# EAGLE design 64Pin-2 (EAGLE 7.2.0)
64 Pin Board to mount PIC24FJ1024GB606E
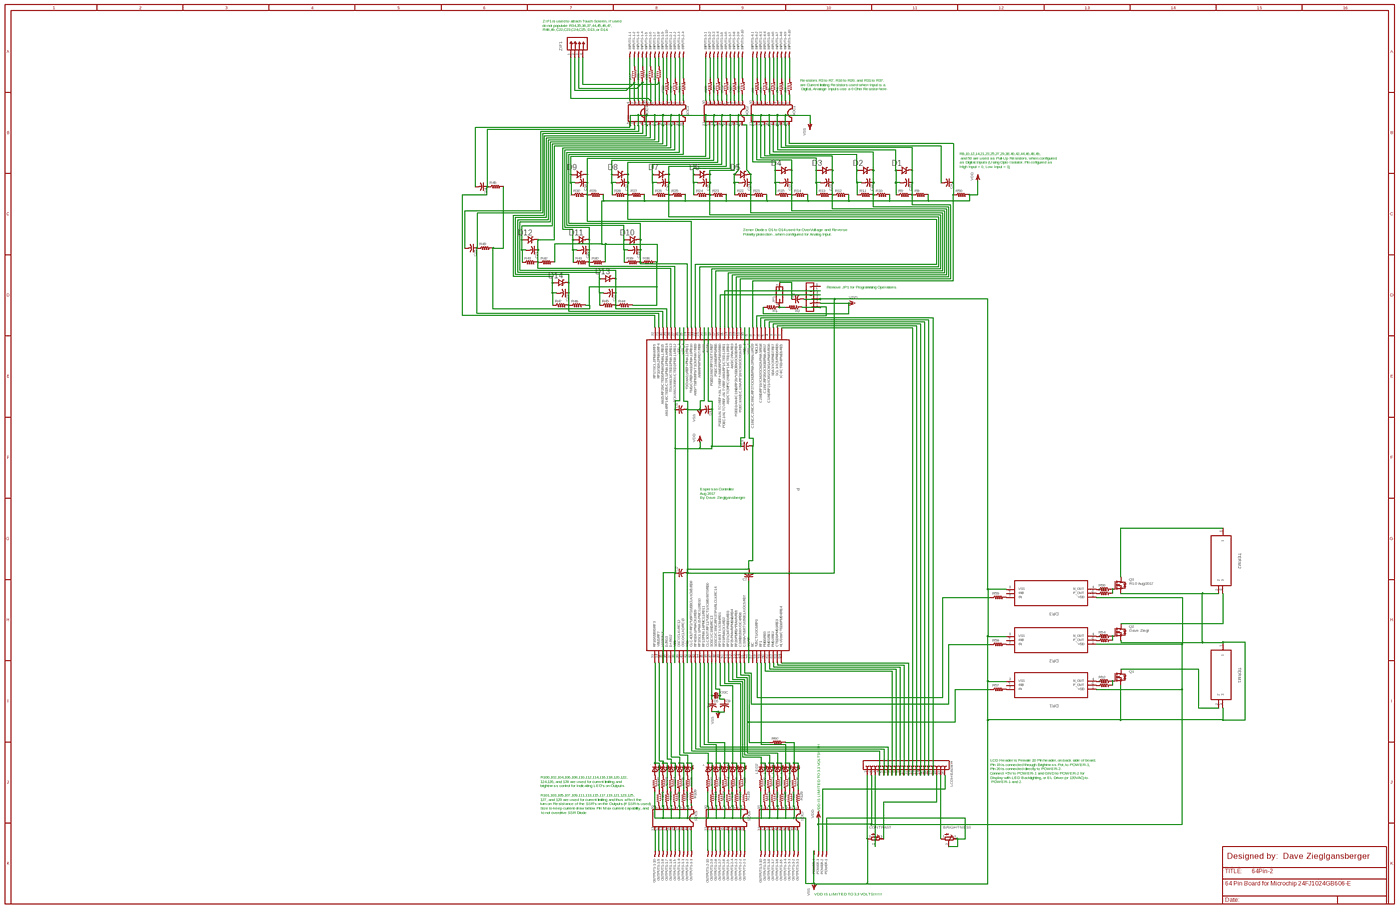
[diagram p0: schematic, sheet 1, overview]
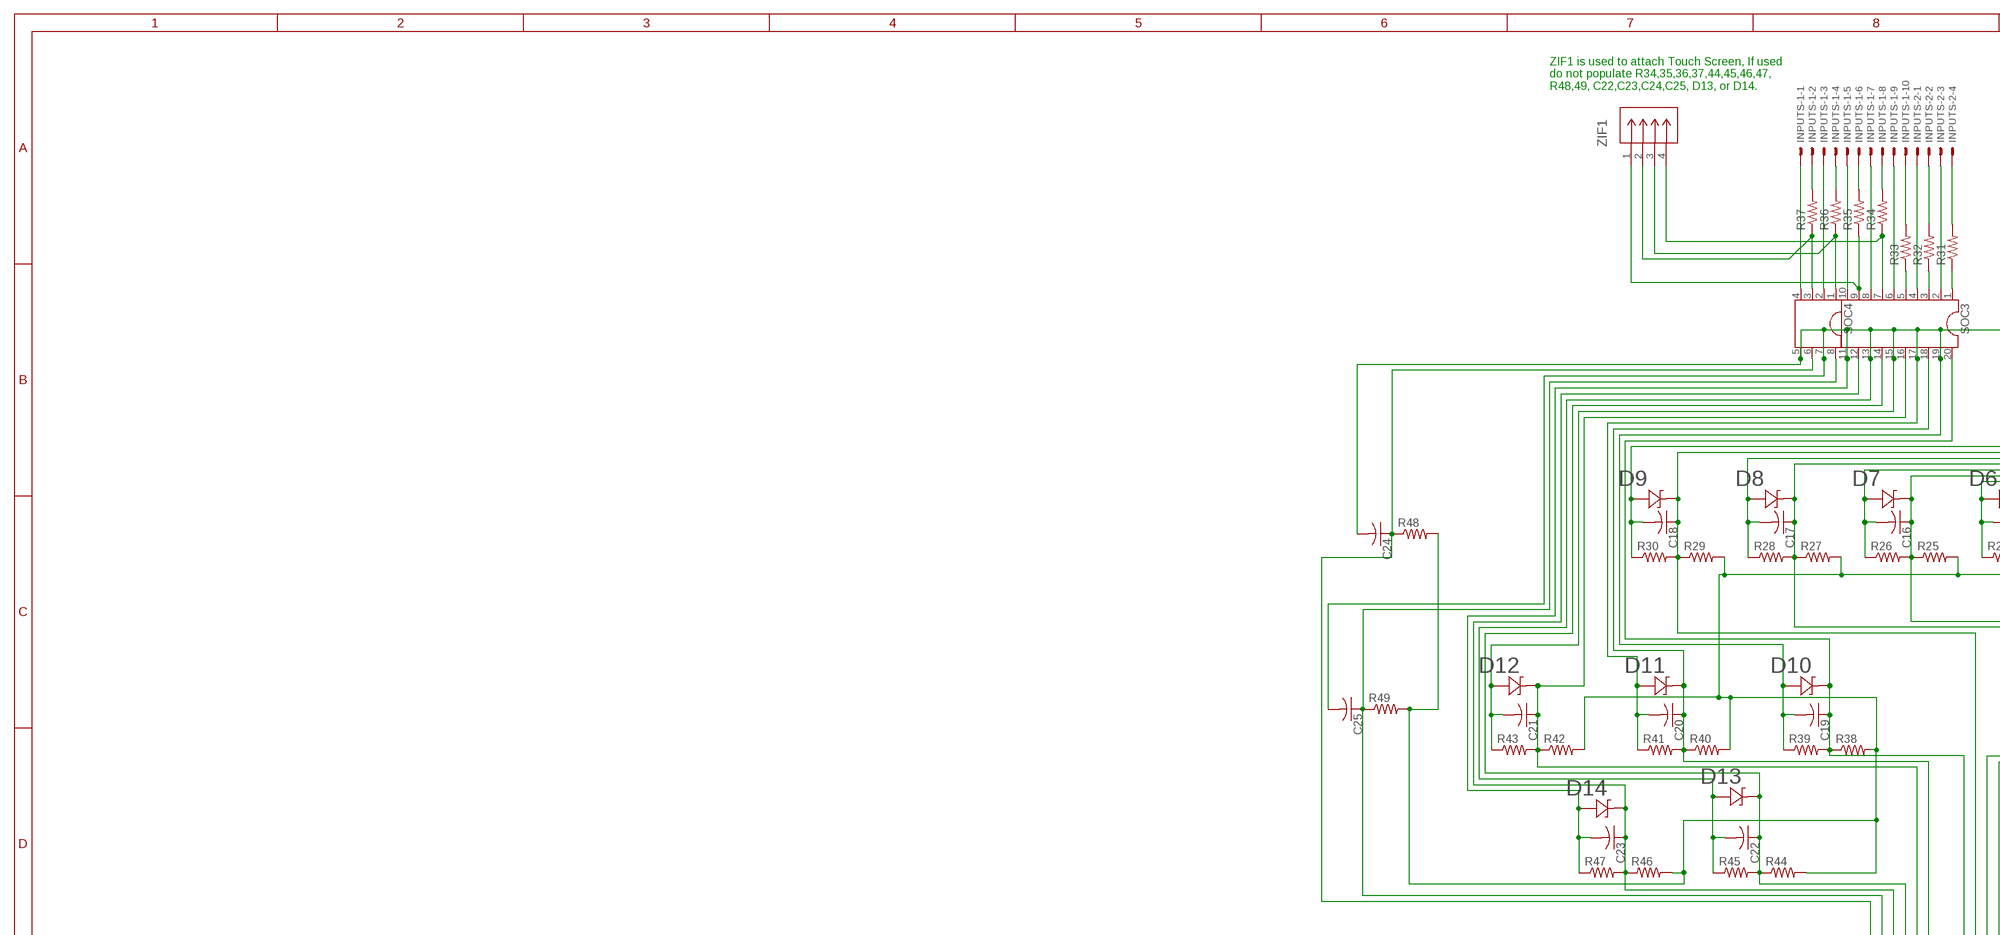
[diagram p1: schematic, sheet 1, part 1 of 4]
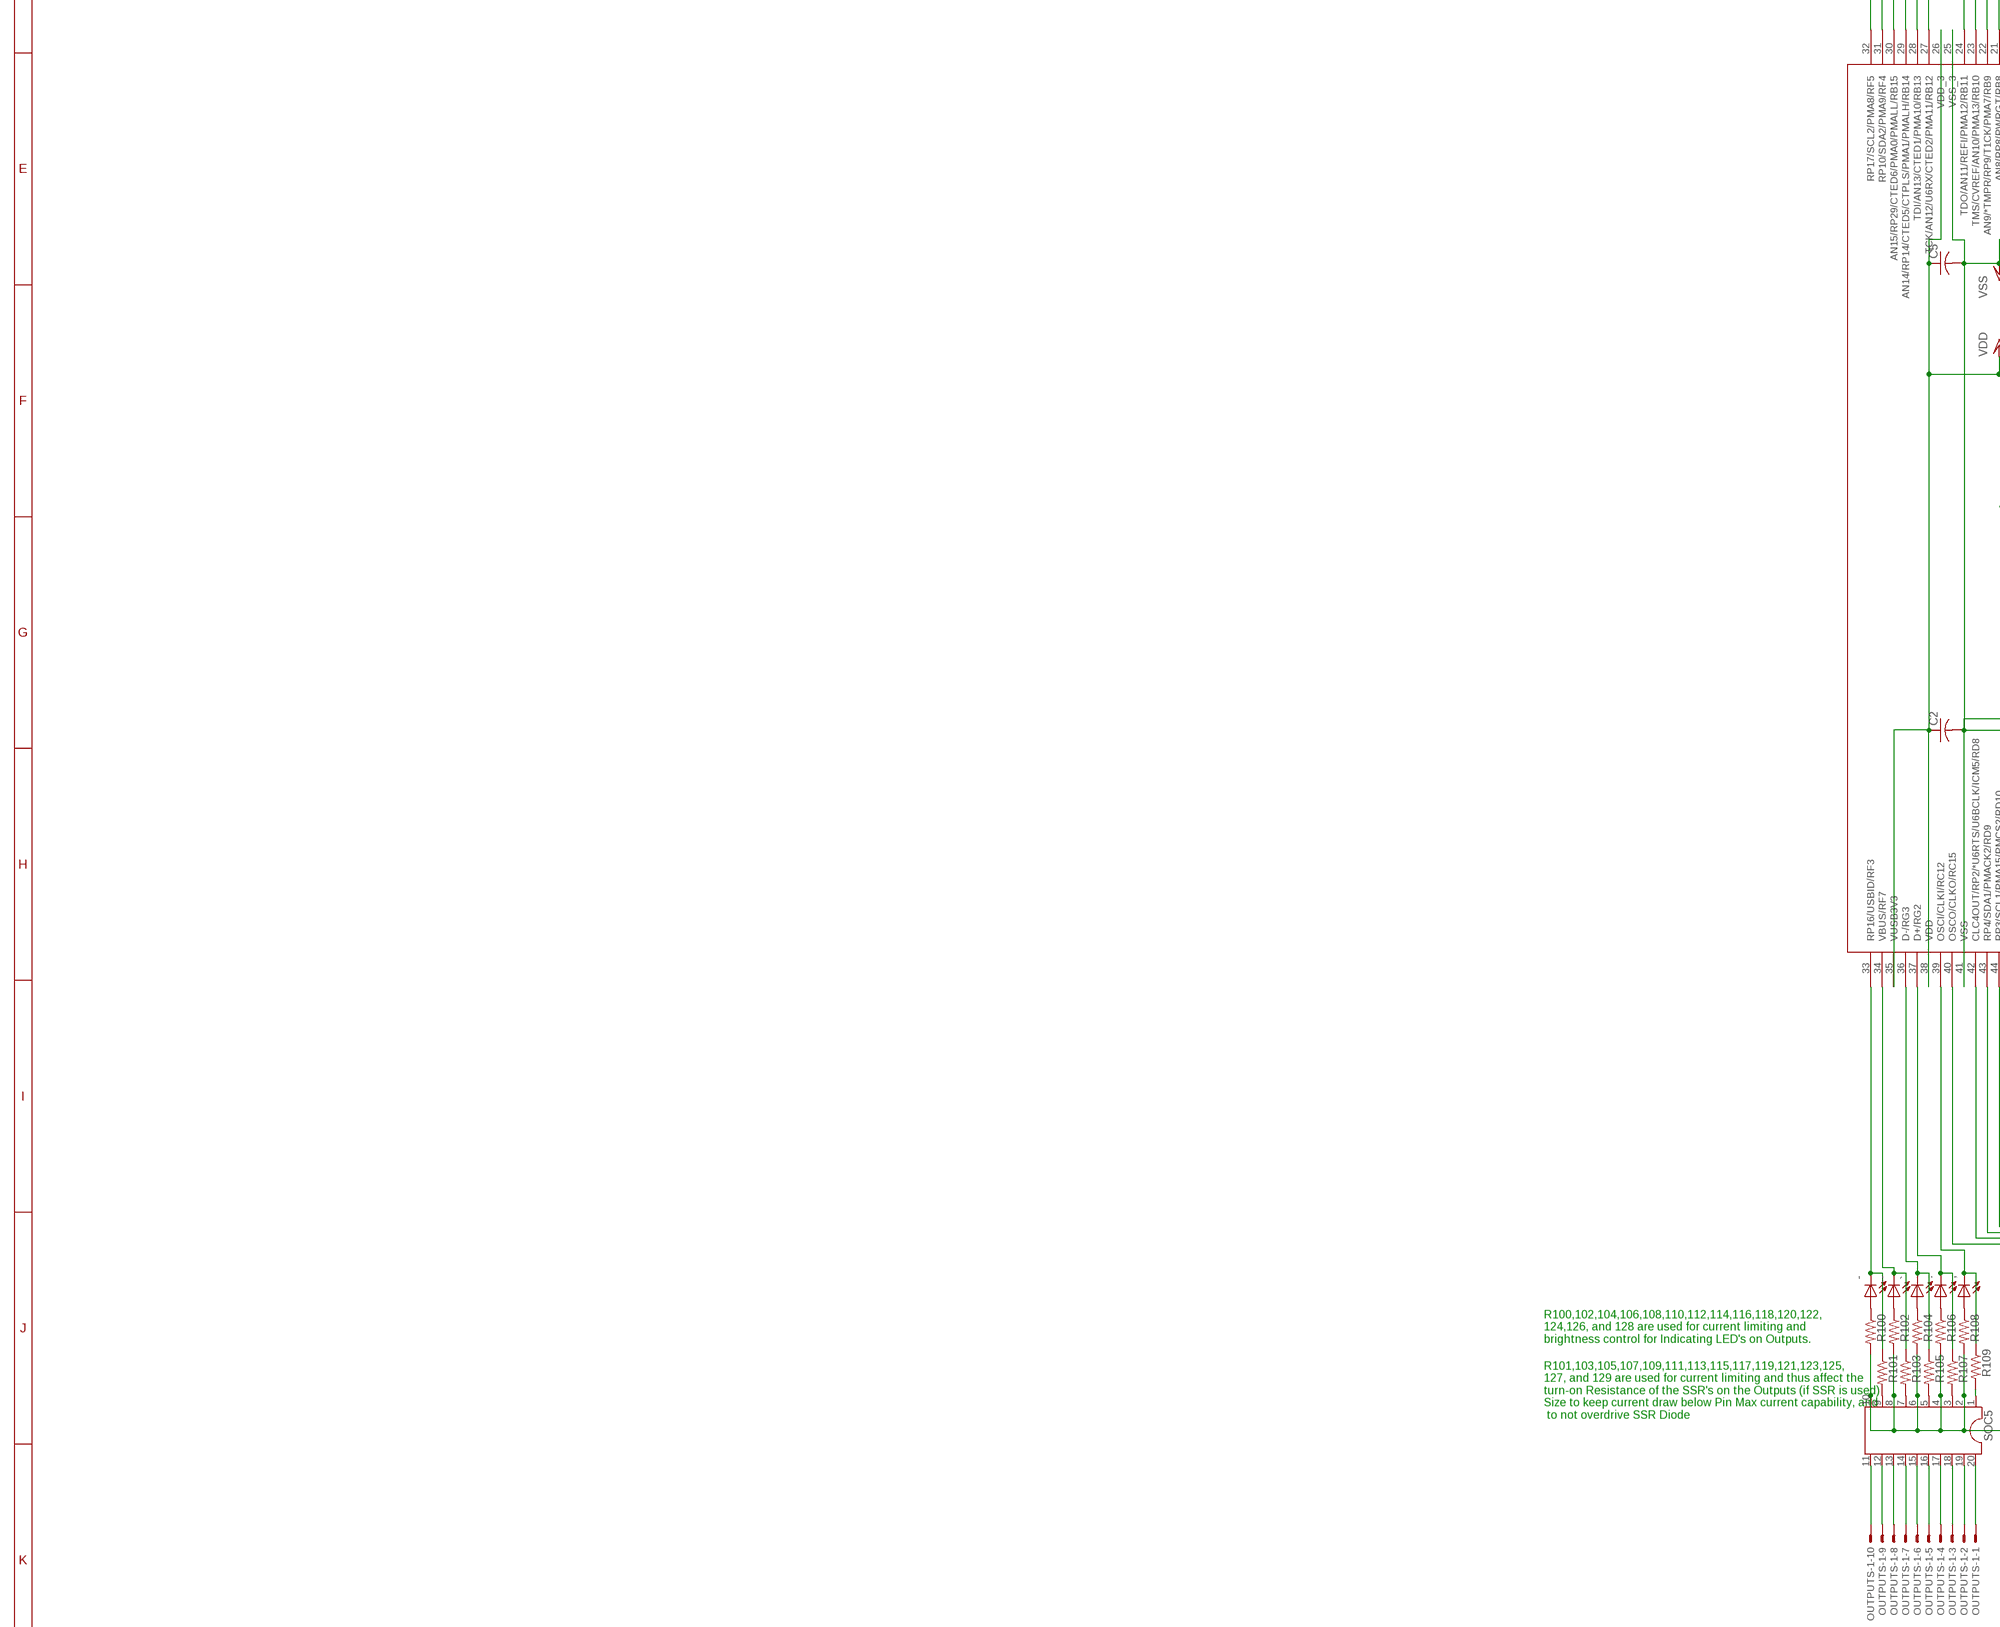
[diagram p2: schematic, sheet 1, part 2 of 4]
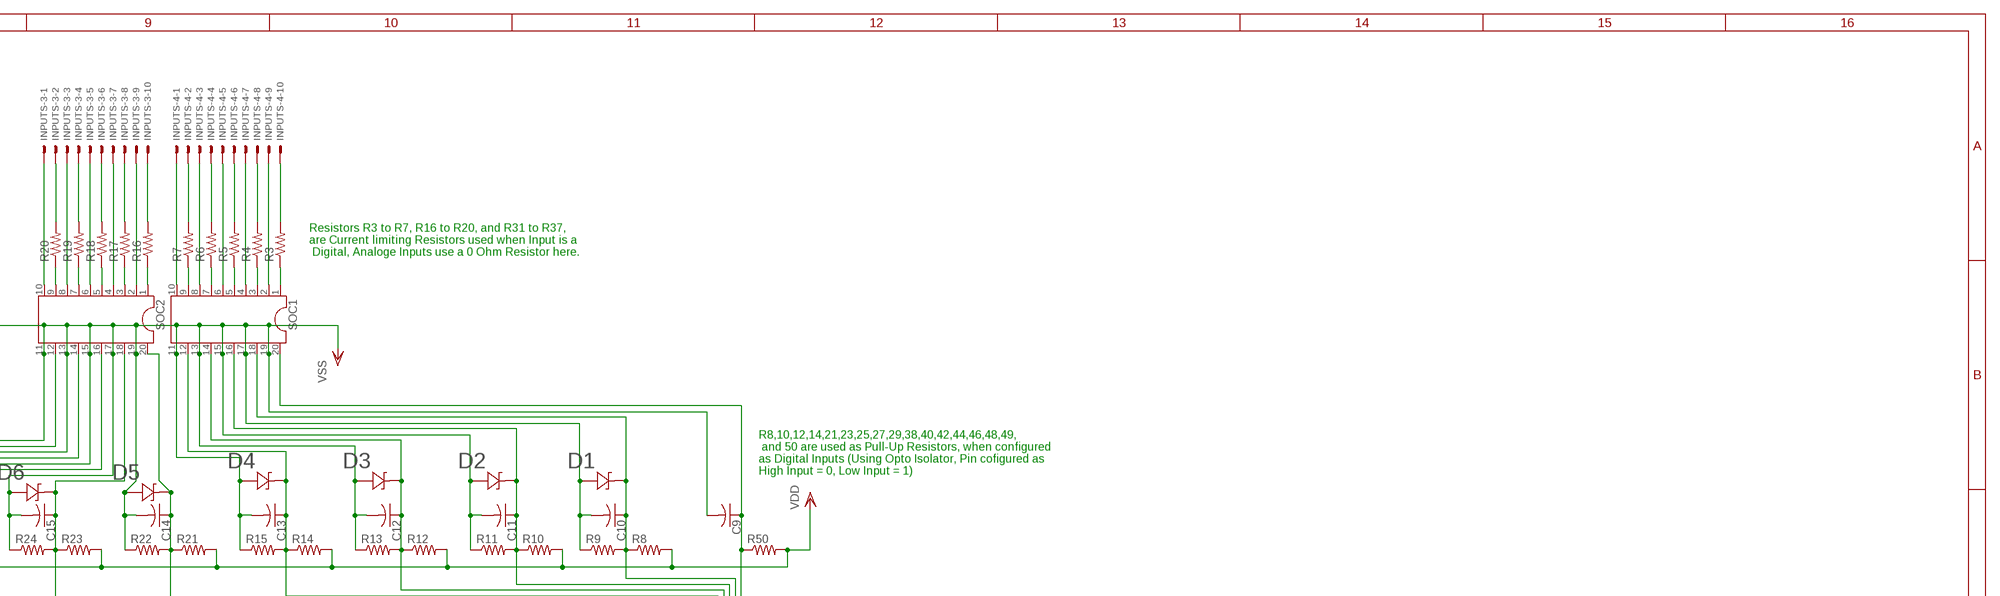
[diagram p3: schematic, sheet 1, part 3 of 4]
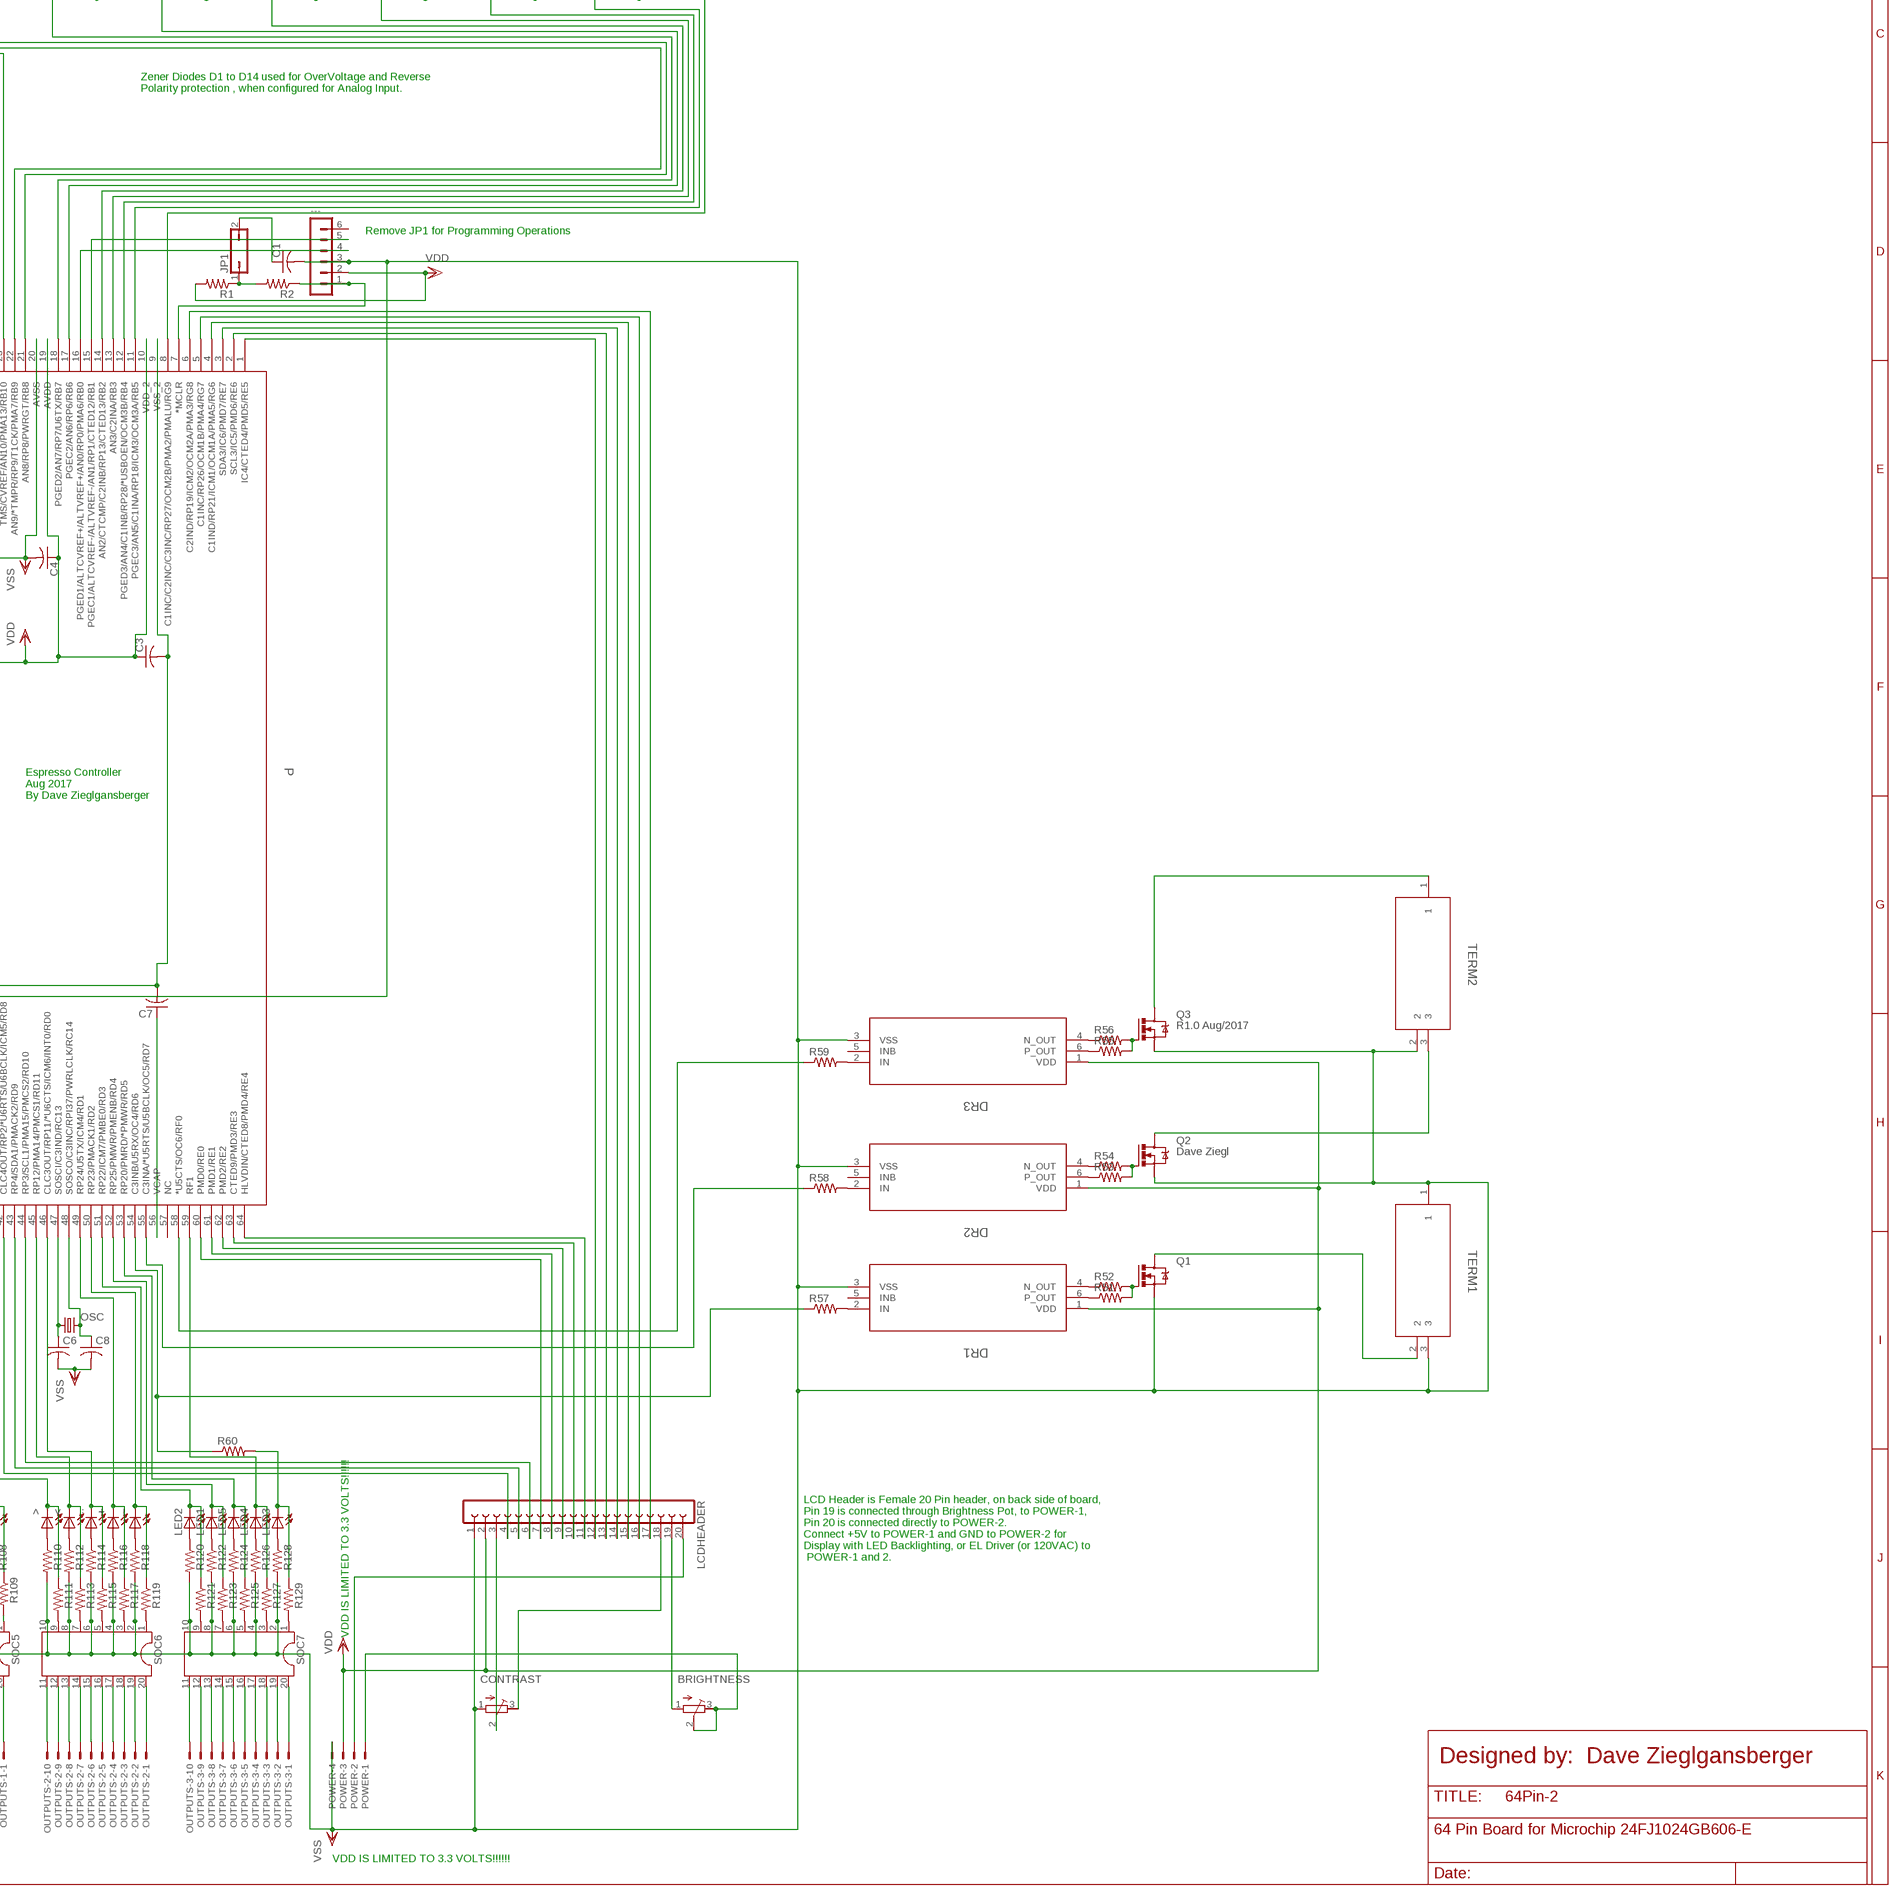
[diagram p4: schematic, sheet 1, part 4 of 4]

## Parts
+  LED_ESML0603  [LED_SML0603]
,  LED_ESML0603  [LED_SML0603]
-  LED_ESML0603  [LED_SML0603]
--  LED_ESML0603  [LED_SML0603]
---  MA06-1  [MA06-1]
.  LED_ESML0603  [LED_SML0603]
..  LED_ESML0603  [LED_SML0603]
<  LED_ESML0603  [LED_SML0603]
>  LED_ESML0603  [LED_SML0603]
`  LED_ESML0603  [LED_SML0603]
BRIGHTNESS  R-TRIMM3296W  [RTRIM3296W]
C1  C-USC0603  [C0603]
C2  C-USC0603  [C0603]
C3  C-USC0603  [C0603]
C4  C-USC0603  [C0603]
C5  C-USC0603  [C0603]
C6  C-USC0603  [C0603]
C7  C-USC0603  [C0603]
C8  C-USC0603  [C0603]
C9  C-USC0603  [C0603]
C10  C-USC0603  [C0603]
C11  C-USC0603  [C0603]
C12  C-USC0603  [C0603]
C13  C-USC0603  [C0603]
C14  C-USC0603  [C0603]
C15  C-USC0603  [C0603]
C16  C-USC0603  [C0603]
C17  C-USC0603  [C0603]
C18  C-USC0603  [C0603]
C19  C-USC0603  [C0603]
C20  C-USC0603  [C0603]
C21  C-USC0603  [C0603]
C22  C-USC0603  [C0603]
C23  C-USC0603  [C0603]
C24  C-USC0603  [C0603]
C25  C-USC0603  [C0603]
CONTRAST  R-TRIMM3296W  [RTRIM3296W]
D1  CZRU52C3V3CZRU-M  [CZRU-M]
D2  CZRU52C3V3CZRU-M  [CZRU-M]
D3  CZRU52C3V3CZRU-M  [CZRU-M]
D4  CZRU52C3V3CZRU-M  [CZRU-M]
D5  CZRU52C3V3CZRU-M  [CZRU-M]
D6  CZRU52C3V3CZRU-M  [CZRU-M]
D7  CZRU52C3V3CZRU-M  [CZRU-M]
D8  CZRU52C3V3CZRU-M  [CZRU-M]
D9  CZRU52C3V3CZRU-M  [CZRU-M]
D10  CZRU52C3V3CZRU-M  [CZRU-M]
D11  CZRU52C3V3CZRU-M  [CZRU-M]
D12  CZRU52C3V3CZRU-M  [CZRU-M]
D13  CZRU52C3V3CZRU-M  [CZRU-M]
D14  CZRU52C3V3CZRU-M  [CZRU-M]
DR1  LM5114BMFX/S7003094SOT26-GATEDRIVER  [MF06A]
DR2  LM5114BMFX/S7003094SOT26-GATEDRIVER  [MF06A]
DR3  LM5114BMFX/S7003094SOT26-GATEDRIVER  [MF06A]
INPUTS-1  22-23-2101  [22-23-2101]
INPUTS-2  22-23-2041  [22-23-2041]
INPUTS-3  22-23-2101  [22-23-2101]
INPUTS-4  22-23-2101  [22-23-2101]
JP1  JP1Q  [JP1]
LCDHEADER  FE20-1  [FE20]
LED1  LED_ESML0603  [LED_SML0603]
LED2  LED_ESML0603  [LED_SML0603]
LED3  LED_ESML0603  [LED_SML0603]
LED4  LED_ESML0603  [LED_SML0603]
LED5  LED_ESML0603  [LED_SML0603]
OSC  CRYSTALTC26H  [TC26H]
OUTPUTS-1  22-23-2101  [22-23-2101]
OUTPUTS-2  22-23-2101  [22-23-2101]
OUTPUTS-3  22-23-2101  [22-23-2101]
P  PIC24FJXXXGB606-X_PT  [TQFP64_10X10MC]
POWER  22-23-2041  [22-23-2041]
Q1  IRF540  [TO220BV]
Q2  Dave Ziegl  IRF540  [TO220BV]
Q3  R1.0 Aug/2017  IRF540  [TO220BV]
R1  R-US_R0603  [R0603]
R2  R-US_R0603  [R0603]
R3  R-US_R0603  [R0603]
R4  R-US_R0603  [R0603]
R5  R-US_R0603  [R0603]
R6  R-US_R0603  [R0603]
R7  R-US_R0603  [R0603]
R8  R-US_R0603  [R0603]
R9  R-US_R0603  [R0603]
R10  R-US_R0603  [R0603]
R11  R-US_R0603  [R0603]
R12  R-US_R0603  [R0603]
R13  R-US_R0603  [R0603]
R14  R-US_R0603  [R0603]
R15  R-US_R0603  [R0603]
R16  R-US_R0603  [R0603]
R17  R-US_R0603  [R0603]
R18  R-US_R0603  [R0603]
R19  R-US_R0603  [R0603]
R20  R-US_R0603  [R0603]
R21  R-US_R0603  [R0603]
R22  R-US_R0603  [R0603]
R23  R-US_R0603  [R0603]
R24  R-US_R0603  [R0603]
R25  R-US_R0603  [R0603]
R26  R-US_R0603  [R0603]
R27  R-US_R0603  [R0603]
R28  R-US_R0603  [R0603]
R29  R-US_R0603  [R0603]
R30  R-US_R0603  [R0603]
R31  R-US_R0603  [R0603]
R32  R-US_R0603  [R0603]
R33  R-US_R0603  [R0603]
R34  R-US_R0603  [R0603]
R35  R-US_R0603  [R0603]
R36  R-US_R0603  [R0603]
R37  R-US_R0603  [R0603]
R38  R-US_R0603  [R0603]
R39  R-US_R0603  [R0603]
R40  R-US_R0603  [R0603]
R41  R-US_R0603  [R0603]
R42  R-US_R0603  [R0603]
R43  R-US_R0603  [R0603]
R44  R-US_R0603  [R0603]
R45  R-US_R0603  [R0603]
R46  R-US_R0603  [R0603]
R47  R-US_R0603  [R0603]
R48  R-US_R0603  [R0603]
R49  R-US_R0603  [R0603]
R50  R-US_R0603  [R0603]
R51  R-US_R0603  [R0603]
R52  R-US_R0603  [R0603]
R53  R-US_R0603  [R0603]
R54  R-US_R0603  [R0603]
R55  R-US_R0603  [R0603]
R56  R-US_R0603  [R0603]
R57  R-US_R0603  [R0603]
R58  R-US_R0603  [R0603]
R59  R-US_R0603  [R0603]
R60  R-US_R0603  [R0603]
R100  R-US_R0603  [R0603]
R101  R-US_R0603  [R0603]
R102  R-US_R0603  [R0603]
R103  R-US_R0603  [R0603]
R104  R-US_R0603  [R0603]
R105  R-US_R0603  [R0603]
R106  R-US_R0603  [R0603]
R107  R-US_R0603  [R0603]
R108  R-US_R0603  [R0603]
R109  R-US_R0603  [R0603]
R110  R-US_R0603  [R0603]
R111  R-US_R0603  [R0603]
R112  R-US_R0603  [R0603]
R113  R-US_R0603  [R0603]
R114  R-US_R0603  [R0603]
R115  R-US_R0603  [R0603]
R116  R-US_R0603  [R0603]
R117  R-US_R0603  [R0603]
R118  R-US_R0603  [R0603]
R119  R-US_R0603  [R0603]
R120  R-US_R0603  [R0603]
R121  R-US_R0603  [R0603]
R122  R-US_R0603  [R0603]
R123  R-US_R0603  [R0603]
R124  R-US_R0603  [R0603]
R125  R-US_R0603  [R0603]
R126  R-US_R0603  [R0603]
R127  R-US_R0603  [R0603]
R128  R-US_R0603  [R0603]
R129  R-US_R0603  [R0603]
SOC1  DIL20  [DIL20]
SOC2  DIL20  [DIL20]
SOC3  DIL20  [DIL20]
SOC4  DIL8  [DIL08]
SOC5  DIL20  [DIL20]
SOC6  DIL20  [DIL20]
SOC7  DIL20  [DIL20]
TERM1  282837-3  [282837-3]
TERM2  282837-3  [282837-3]
ZIF1  84952-4  [CON4_SMT-RA_FCC-FPC2]
~  LED_ESML0603  [LED_SML0603]

## Nets
MCLR: ---.1 P.7(*MCLR) R2.1
N$1: INPUTS-1.1 SOC4.4
N$3: R101.2 SOC5.9
N$4: JP1.1 R1.1 R2.2
N$5: INPUTS-1.2 R37.2
N$6: R103.2 SOC5.7
N$7: INPUTS-1.3 SOC4.2
N$8: R105.2 SOC5.5
N$11: INPUTS-1.4 R36.2
N$13: R107.2 SOC5.3
N$17: INPUTS-1.5 SOC3.10
N$19: R36.1 SOC4.1 ZIF1.3
N$20: C1.1 JP1.2
N$21: R37.1 SOC4.3 ZIF1.2
N$23: INPUTS-1.6 R35.2
N$24: INPUTS-1.7 SOC3.8
N$25: INPUTS-1.8 R34.2
N$26: INPUTS-1.9 SOC3.6
N$27: R109.2 SOC5.1
N$28: INPUTS-1.10 R33.2
N$29: INPUTS-2.1 SOC3.4
N$30: INPUTS-2.2 R32.2
N$31: INPUTS-2.3 SOC3.2
N$32: INPUTS-2.4 R31.2
N$33: DR2.4(N_OUT) R54.1
N$34: DR2.6(P_OUT) R53.1
N$35: DR1.4(N_OUT) R52.1
N$36: -.A R100.1
N$37: --.A R102.1
N$38: `.A R104.1
N$39: ..A R106.1
N$40: ,.A R108.1
N$41: DR1.6(P_OUT) R51.1
N$42: >.A R110.1
N$43: R111.2 SOC6.9
N$44: INPUTS-4.5 SOC1.6
N$45: INPUTS-4.4 R6.2
N$46: Q3.D TERM2.1
N$47: R113.2 SOC6.7
N$48: Q1.G R51.2 R52.2
N$49: R115.2 SOC6.5
N$50: Q2.G R53.2 R54.2
N$51: R117.2 SOC6.3
N$52: DR3.4(N_OUT) R56.1
N$53: R119.2 SOC6.1
N$54: R6.1 SOC1.7
N$55: R118.1 ~.A
N$56: +.A R116.1
N$57: ...A R114.1
N$58: <.A R112.1
N$59: DR3.6(P_OUT) R55.1
N$60: R121.2 SOC7.9
N$61: Q3.G R55.2 R56.2
N$62: R123.2 SOC7.7
N$63: LCDHEADER.20 POWER.2
N$64: R125.2 SOC7.5
N$65: Q2.D TERM2.3
N$66: R127.2 SOC7.3
N$68: R129.2 SOC7.1
N$69: LED3.A R128.1
N$70: LED4.A R126.1
N$71: LED5.A R124.1
N$72: LED1.A R122.1
N$73: LED2.A R120.1
N$74: Q1.D TERM1.2
N$75: BRIGHTNESS.1(A) LCDHEADER.19
N$76 [VDD]: BRIGHTNESS.2(S) BRIGHTNESS.3(E) POWER.1
N$77: DR1.2(IN) R57.2
N$78: DR2.2(IN) R58.2
N$79: DR3.2(IN) R59.2
N$80: P.55(C3INA/*U5RTS/U5BCLK/OC5/RD7) R58.1
N$81: P.58(*U5CTS/OC6/RF0) R59.1
N$84: R35.1 SOC3.9 ZIF1.1
N$87: R34.1 SOC3.7 ZIF1.4
N$90: R33.1 SOC3.5
N$93: R32.1 SOC3.3
N$95: R31.1 SOC3.1
N$96: INPUTS-3.1 SOC2.10
N$98: R20.1 SOC2.9
N$99: INPUTS-3.3 SOC2.8
N$100: INPUTS-3.2 R20.2
N$101: INPUTS-3.4 R19.2
N$102: INPUTS-3.5 SOC2.6
N$103: R19.1 SOC2.7
N$104: INPUTS-3.7 SOC2.4
N$105: R17.1 SOC2.3
N$106: INPUTS-3.8 R17.2
N$107: INPUTS-3.9 SOC2.2
N$108: R16.1 SOC2.1
N$109: INPUTS-3.10 R16.2
N$110: INPUTS-4.1 SOC1.10
N$111: INPUTS-4.2 R7.2
N$112: R7.1 SOC1.9
N$113: INPUTS-4.3 SOC1.8
N$114: R18.1 SOC2.5
N$115: INPUTS-3.6 R18.2
N$116: INPUTS-4.6 R5.2
N$117: R5.1 SOC1.5
N$118: INPUTS-4.7 SOC1.4
N$119: INPUTS-4.8 R4.2
N$120: R4.1 SOC1.3
N$121: INPUTS-4.9 SOC1.2
N$122: INPUTS-4.10 R3.2
N$123: R3.1 SOC1.1
N$149: CONTRAST.2(S) LCDHEADER.3
N$151: CONTRAST.3(E) LCDHEADER.18
OUT: LED3.C R60.2 R129.1
OUT1-1: OUTPUTS-1.10 SOC5.11
OUT1-2 [Output Traces]: OUTPUTS-1.9 SOC5.12
OUT2-1: OUTPUTS-1.8 SOC5.13
OUT2-2: OUTPUTS-1.7 SOC5.14
OUT3-1: OUTPUTS-1.6 SOC5.15
OUT3-2: OUTPUTS-1.5 SOC5.16
OUT4-1: OUTPUTS-1.4 SOC5.17
OUT4-2: OUTPUTS-1.3 SOC5.18
OUT5-1: OUTPUTS-1.2 SOC5.19
OUT5-2: OUTPUTS-1.1 SOC5.20
OUT6-1: OUTPUTS-2.10 SOC6.11
OUT6-2: OUTPUTS-2.9 SOC6.12
OUT7-1: OUTPUTS-2.8 SOC6.13
OUT7-2: OUTPUTS-2.7 SOC6.14
OUT8-1: OUTPUTS-2.6 SOC6.15
OUT8-2: OUTPUTS-2.5 SOC6.16
OUT9-1: OUTPUTS-2.4 SOC6.17
OUT9-2: OUTPUTS-2.3 SOC6.18
OUT10-1: OUTPUTS-2.2 SOC6.19
OUT10-2: OUTPUTS-2.1 SOC6.20
OUT11-1: OUTPUTS-3.10 SOC7.11
OUT11-2: OUTPUTS-3.9 SOC7.12
OUT12-1: OUTPUTS-3.8 SOC7.13
OUT12-2: OUTPUTS-3.7 SOC7.14
OUT13-1: OUTPUTS-3.6 SOC7.15
OUT13-2: OUTPUTS-3.5 SOC7.16
OUT14-1: OUTPUTS-3.4 SOC7.17
OUT14-2: OUTPUTS-3.3 SOC7.18
OUT15-1: OUTPUTS-3.2 SOC7.19
OUT15-2: OUTPUTS-3.1 SOC7.20
PGEC1: ---.5 P.15(PGEC1/ALTCVREF-/ALTVREF-/AN1/RP1/CTED12/RB1)
PGECD: ---.4 P.16(PGED1/ALTCVREF+/ALTVREF+/AN0/RP0/PMA6/RB0)
PIN1: LCDHEADER.12 P.1(IC4/CTED4/PMD5/RE5)
PIN2: LCDHEADER.13 P.2(SCL3/IC5/PMD6/RE6)
PIN3: LCDHEADER.14 P.3(SDA3/IC6/PMD7/RE7)
PIN4: LCDHEADER.15 P.4(C1IND/RP21/ICM1/OCM1A/PMA5/RG6)
PIN5: LCDHEADER.16 P.5(C1INC/RP26/OCM1B/PMA4/RG7)
PIN6: LCDHEADER.17 P.6(C2IND/RP19/ICM2/OCM2A/PMA3/RG8)
PIN8: C9.1 P.8(C1INC/C2INC/C3INC/RP27/OCM2B/PMA2/PMALU/RG9) R50.1 SOC1.20
PIN11: C10.1 D1.1 P.11(PGEC3/AN5/C1INA/RP18/ICM3/OCM3A/RB5) R8.1 R9.2 SOC1.18
PIN12: C11.1 D2.1 P.12(PGED3/AN4/C1INB/RP28/*USBOEN/OCM3B/RB4) R10.1 R11.2 SOC1.16
PIN13: C12.1 D3.1 P.13(AN3/C2INA/RB3) R12.1 R13.2 SOC1.14
PIN14: C13.1 D4.1 P.14(AN2/CTCMP/C2INB/RP13/CTED13/RB2) R14.1 R15.2 SOC1.12
PIN17: C14.1 D5.1 P.17(PGEC2/AN6/RP6/RB6) R21.1 R22.2 SOC2.20
PIN18: C15.1 D6.1 P.18(PGED2/AN7/RP7/U6TX/RB7) R23.1 R24.2 SOC2.18
PIN21: C16.1 D7.1 P.21(AN8/RP8/PWRGT/RB8) R25.1 R26.2 SOC2.16
PIN22: C17.1 D8.1 P.22(AN9/*TMPR/RP9/T1CK/PMA7/RB9) R27.1 R28.2 SOC2.14
PIN23: C18.1 D9.1 P.23(TMS/CVREF/AN10/PMA13/RB10) R29.1 R30.2 SOC2.12
PIN24: C19.1 D10.1 P.24(TDO/AN11/REFI/PMA12/RB11) R38.1 R39.2 SOC3.20
PIN27: C20.1 D11.1 P.27(TCK/AN12/U6RX/CTED2/PMA11/RB12) R40.1 R41.2 SOC3.18
PIN28: C21.1 D12.1 P.28(TDI/AN13/CTED1/PMA10/RB13) R42.1 R43.2 SOC3.16
PIN29: C22.1 D13.1 P.29(AN14/RP14/CTED5/CTPLS/PMA1/PMALH/RB14) R44.1 R45.2 SOC3.14
PIN30: C23.1 D14.1 P.30(AN15/RP29/CTED6/PMA0/PMALL/RB15) R46.1 R47.2 SOC3.12
PIN31: C25.1 P.31(RP10/SDA2/PMA9/RF4) R49.1 SOC4.8
PIN32: C24.1 P.32(RP17/SCL2/PMA8/RF5) R48.1 SOC4.6
PIN33: -.C P.33(RP16/USBID/RF3) R101.1
PIN34: --.C P.34(VBUS/RF7) R103.1
PIN36: `.C P.36(D-/RG3) R105.1
PIN37: ..C P.37(D+/RG2) R107.1
PIN39: ,.C P.39(OSCI/CLKI/RC12) R109.1
PIN40: >.C P.40(OSCO/CLKO/RC15) R111.1
PIN42: LCDHEADER.4 P.42(CLC4OUT/RP2/*U6RTS/U6BCLK/ICM5/RD8)
PIN43: LCDHEADER.5 P.43(RP4/SDA1/PMACK2/RD9)
PIN44: LCDHEADER.6 P.44(RP3/SCL1/PMA15/PMCS2/RD10)
PIN45: <.C P.45(RP12/PMA14/PMCS1/RD11) R113.1
PIN46: ...C P.46(CLC3OUT/RP11/*U6CTS/ICM6/INT0/RD0) R115.1
PIN49: +.C P.49(RP24/U5TX/ICM4/RD1) R117.1
PIN50: P.50(RP23/PMACK1/RD2) R119.1 ~.C
PIN51: LED2.C P.51(RP22/ICM7/PMBE0/RD3) R121.1
PIN52: LED1.C P.52(RP25/PMWR/PMENB/RD4) R123.1
PIN53: LED5.C P.53(RP20/PMRD/*PMWR/RD5) R125.1
PIN54: P.54(C3INB/U5RX/OC4/RD6) R57.1 R60.1
PIN59: LED4.C P.59(RF1) R127.1
PIN60: LCDHEADER.7 P.60(PMD0/RE0)
PIN61: LCDHEADER.8 P.61(PMD1/RE1)
PIN62: LCDHEADER.9 P.62(PMD2/RE2)
PIN63: LCDHEADER.10 P.63(CTED9/PMD3/RE3)
PIN64: LCDHEADER.11 P.64(HLVDIN/CTED8/PMD4/RE4)
SOSCI: C6.1 OSC.1 P.47(SOSCI/C3IND/RC13)
SOSCO: C8.1 OSC.2 P.48(SOSCO/C3INC/RPI37/PWRLCLK/RC14)
VCAP: C7.1 P.56(VCAP)
VDD [VDD]: ---.2 C2.1 C3.1 C4.1 C5.1 DR1.1(VDD) DR2.1(VDD) DR3.1(VDD) LCDHEADER.2 P.10(VDD_2) P.19(AVDD) P.26(VDD_3) P.35(VUSB3V3) P.38(VDD) POWER.3 R1.2 R8.2 R10.2 R12.2 R14.2 R21.2 R23.2 R25.2 R27.2 R29.2 R38.2 R40.2 R42.2 R44.2 R46.2 R48.2 R49.2 R50.2
VSS [VSS]: ---.3 C1.2 C2.2 C3.2 C4.2 C5.2 C6.2 C7.2 C8.2 C9.2 C10.2 C11.2 C12.2 C13.2 C14.2 C15.2 C16.2 C17.2 C18.2 C19.2 C20.2 C21.2 C22.2 C23.2 C24.2 C25.2 CONTRAST.1(A) D1.2 D2.2 D3.2 D4.2 D5.2 D6.2 D7.2 D8.2 D9.2 D10.2 D11.2 D12.2 D13.2 D14.2 DR1.3(VSS) DR2.3(VSS) DR3.3(VSS) LCDHEADER.1 P.9(VSS_2) P.20(AVSS) P.25(VSS_3) P.41(VSS) POWER.4 Q1.S Q2.S Q3.S R9.1 R11.1 R13.1 R15.1 R22.1 R24.1 R26.1 R28.1 R30.1 R39.1 R41.1 R43.1 R45.1 R47.1 R100.2 R102.2 R104.2 R106.2 R108.2 R110.2 R112.2 R114.2 R116.2 R118.2 R120.2 R122.2 R124.2 R126.2 R128.2 SOC1.11 SOC1.13 SOC1.15 SOC1.17 SOC1.19 SOC2.11 SOC2.13 SOC2.15 SOC2.17 SOC2.19 SOC3.11 SOC3.13 SOC3.15 SOC3.17 SOC3.19 SOC4.5 SOC4.7 SOC5.2 SOC5.4 SOC5.6 SOC5.8 SOC5.10 SOC6.2 SOC6.4 SOC6.6 SOC6.8 SOC6.10 SOC7.2 SOC7.4 SOC7.6 SOC7.8 SOC7.10 TERM1.1 TERM1.3 TERM2.2
Unconnected: ---.6 DR1.5(INB) DR2.5(INB) DR3.5(INB) P.57(NC)

## Notes on the sheet
- ZIF1 is used to attach Touch Screen, If used
  do not populate R34,35,36,37,44,45,46,47,
  R48,49, C22,C23,C24,C25, D13, or D14.
- Resistors R3 to R7, R16 to R20, and R31 to R37,
  are Current limiting Resistors used when Input is a
   Digital, Analoge Inputs use a 0 Ohm Resistor here.
- R8,10,12,14,21,23,25,27,29,38,40,42,44,46,48,49,
   and 50 are used as Pull-Up Resistors, when configured
  as Digital Inputs (Using Opto Isolator, Pin cofigured as
  High Input = 0, Low Input = 1)
- Zener Diodes D1 to D14 used for OverVoltage and Reverse
  Polarity protection , when configured for Analog Input.
- Remove JP1 for Programming Operations
- Espresso Controller
  Aug 2017
  By Dave Zieglgansberger
- LCD Header is Female 20 Pin header, on back side of board,
  Pin 19 is connected through Brightness Pot, to POWER-1, 
  Pin 20 is connected directly to POWER-2. 
  Connect +5V to POWER-1 and GND to POWER-2 for
  Display with LED Backlighting, or EL Driver (or 120VAC) to
   POWER-1 and 2.
- R100,102,104,106,108,110,112,114,116,118,120,122,
  124,126, and 128 are used for current limiting and 
  brightness control for Indicating LED's on Outputs.
- VDD IS LIMITED TO 3.3 VOLTS!!!!!!
- R101,103,105,107,109,111,113,115,117,119,121,123,125,
  127, and 129 are used for current limiting and thus affect the 
  turn-on Resistance of the SSR's on the Outputs (if SSR is used)
  Size to keep current draw below Pin Max current capability, and
   to not overdrive SSR Diode
- VDD IS LIMITED TO 3.3 VOLTS!!!!!!

## Library data of the parts
+ , - -- . .. < > ` LED1-LED5 ~ = eagle-ltspice:LED_E: LED Source: http://www.osram.convergy.de Source: www.luxeon.com Source: www.kingbright.com; SPICEMODEL: NONE; SPICEPREFIX: D; SPICETYPE: diode
--- = con-lstb:MA06-1: PIN HEADER; OC_FARNELL: unknown; OC_NEWARK: unknown
BRIGHTNESS CONTRAST = rcl:R-TRIMM: Trimm resistor
C1-C25 = rcl:C-US: CAPACITOR, American symbol
D1-D14 = 0603ZenerDiode:CZRU52C3V3; MANUFACTURER_PART_NUMBER: CZRU52C3V3; VENDOR: Comchip
DR1-DR3 = SOT26:LM5114BMFX/S7003094: SOT26 Gate Driver
INPUTS-1 INPUTS-3 INPUTS-4 OUTPUTS-1-OUTPUTS-3 = con-molex:22-23-2101: .100" (2.54mm) Center Header - 10 Pin; MF: MOLEX; MPN: 22-23-2101; OC_FARNELL: 1756828; OC_NEWARK: 94C0765
INPUTS-2 POWER = con-molex:22-23-2041: .100" (2.54mm) Center Header - 4 Pin; MF: MOLEX; MPN: 22-23-2041; OC_FARNELL: 1462920; OC_NEWARK: 38C0355
JP1 = jumper:JP1Q: JUMPER
LCDHEADER = con-lsta:FE20-1: FEMALE HEADER; OC_FARNELL: unknown; OC_NEWARK: unknown
OSC = crystal:CRYSTAL: CRYSTAL; MF: 32.768KHz; OC_FARNELL: unknown; OC_NEWARK: unknown
P = 24FJ1024GB606PT:PIC24FJXXXGB606-X_PT; MANUFACTURER_PART_NUMBER: pic24fjxxxgb606-x_pt; VENDOR: Microchip
Q1-Q3 = transistor-power:IRF540: HEXFET Power MOSFET
R1-R60 R100-R129 = resistor:R-US_: RESISTOR, American symbol
SOC1-SOC3 SOC5-SOC7 = ic-package:DIL20: Dual In Line / Socket
SOC4 = ic-package:DIL8: Dual In Line / Socket
TERM1 TERM2 = 3-Pin-5.08:282837-3; MANUFACTURER_PART_NUMBER: 2828373; VENDOR: Tyco Electronics
ZIF1 = ZIF-4:84952-4; MANUFACTURER_PART_NUMBER: 849524; VENDOR: Tyco Electronics

## Net classes
0 default: width 0.254 mm, clearance 0.205 mm
1 VDD: width 0.254 mm
2 VSS: width 0.254 mm
3 Output Traces: width 0.508 mm

## Board
64 Pin Mount for PIC24FJ1024GB606E
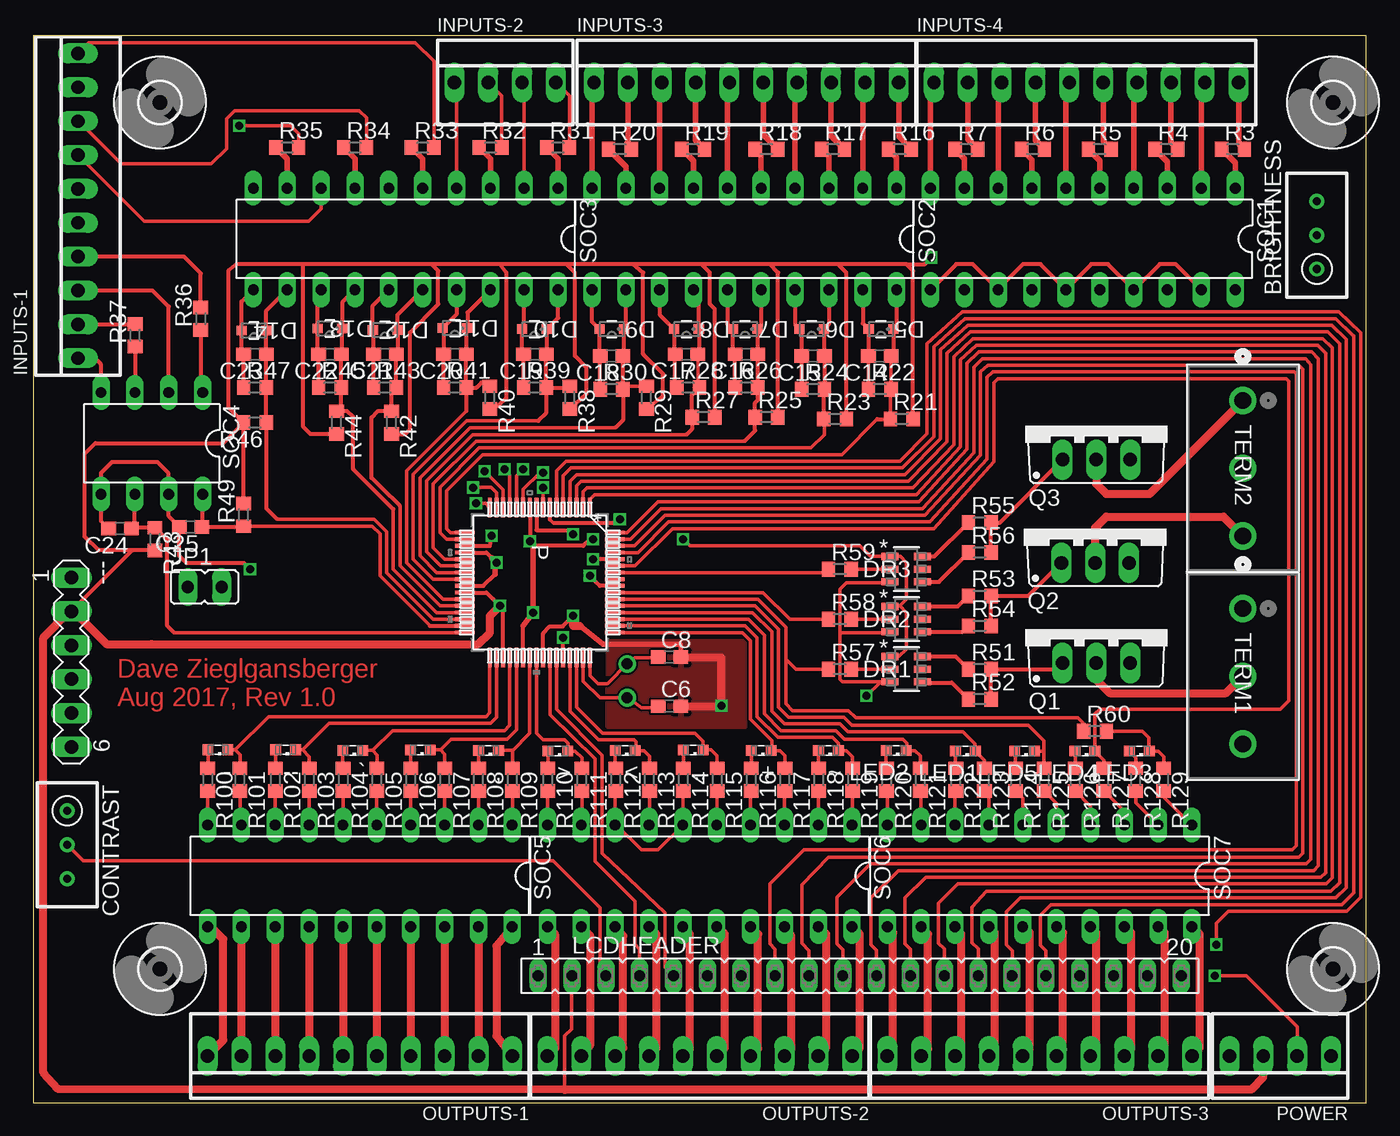
[diagram p5: board, top side]
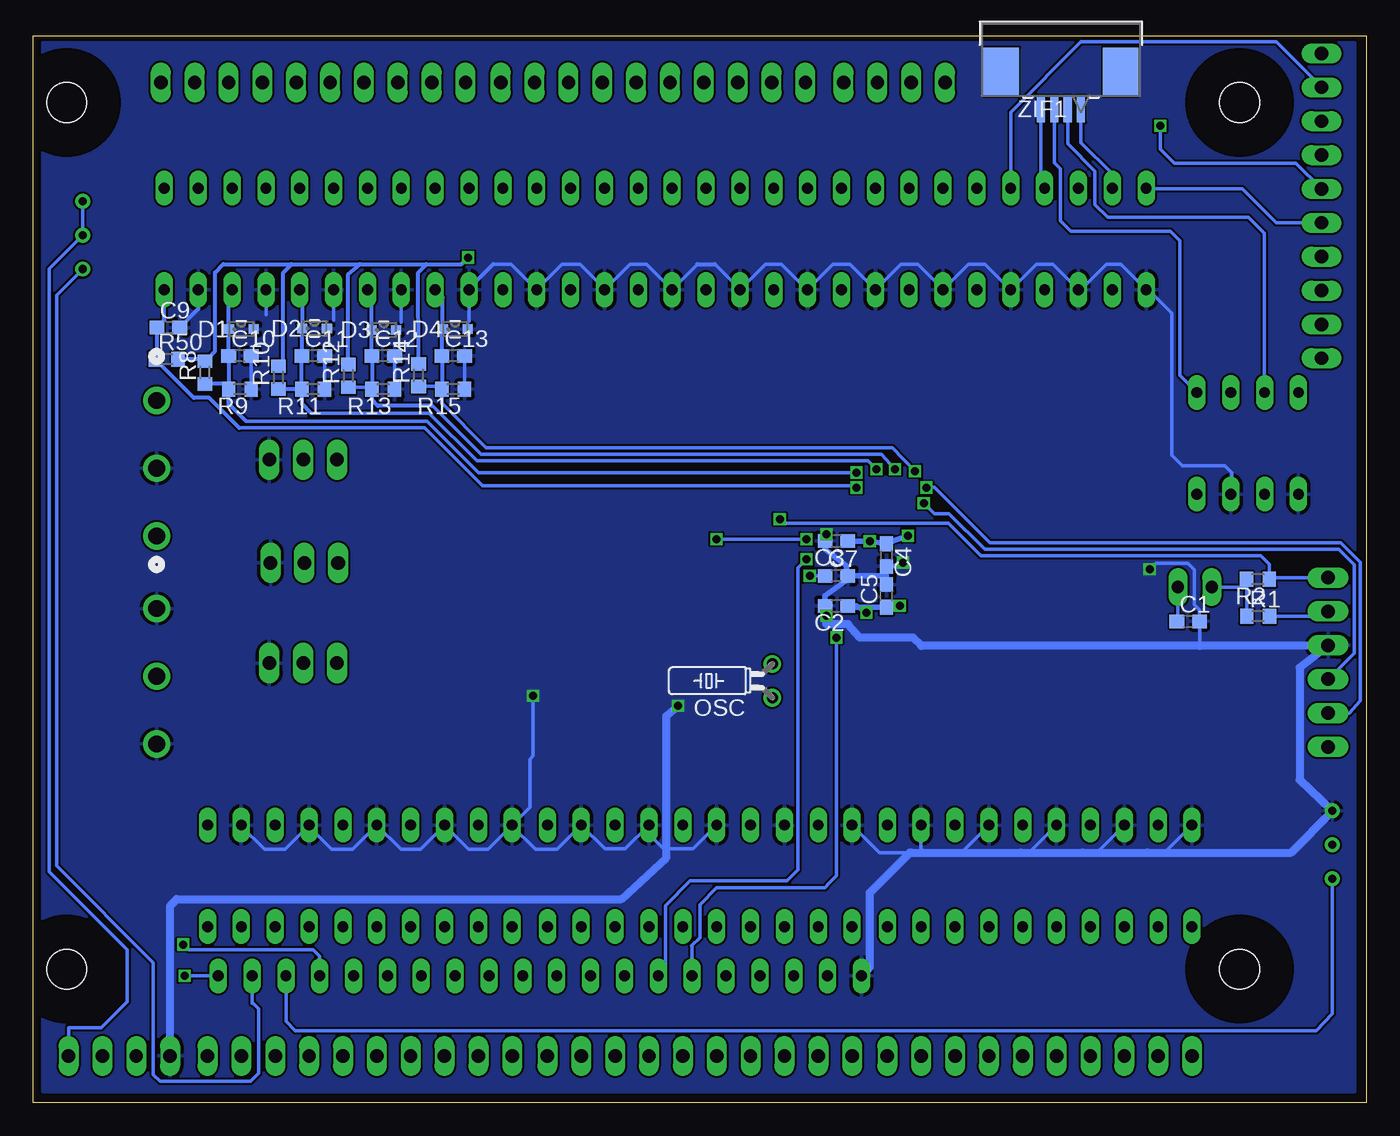
[diagram p6: board, bottom side, seen from below]

Size 100 x 80 mm. Coordinates in mm from the lower left corner, seen from the top.
Outline: 0,0 100,0 100,80 0,80 0,0
Copper layers (1*16): Top 0.035mm / dielectric 1.5mm / Bottom 0.035mm
Design rules "SeeedStudio_2layer_DRU_no_angle_20140221 *": minimum track width 6mil, minimum drill 12mil, track to track 6mil, track to pad 6mil, pad to pad 6mil, via to via 6mil, smd to smd 0mil, copper to edge 10mil, drill to drill 10mil, minimum pad ring 10mil, minimum via ring 6mil, stop-mask expansion 2mil, vias tented up to drill 100mil, thermal gap 10mil

### Footprints (pad centres in the part's own frame; a part is rotated, then mirrored left to right if it is on the bottom)
LED_SML0603 = smd 0.8 x 0.8: A 0.75,0; C -0.75,0
MA06-1 = drill 1.016 long: 1 -6.35,0; 2 -3.81,0; 3 -1.27,0; 4 1.27,0; 5 3.81,0; 6 6.35,0
RTRIM3296W = drill 0.61: 1 0,-2.54; 2 0,0; 3 0,2.54
C0603 = smd 1.1 x 1: 1 -0.85,0; 2 0.85,0
CZRU-M = smd 0.762 x 0.711: 1 -0.927,0; 2 0.927,0
MF06A = smd 1.27 x 0.533: 1 -1.219,0.953; 2 -1.219,0; 3 -1.219,-0.953; 4 1.219,-0.953; 5 1.219,0; 6 1.219,0.953
22-23-2101 = drill 1 long: 1 -11.43,0; 2 -8.89,0; 3 -6.35,0; 4 -3.81,0; 5 -1.27,0; 6 1.27,0; 7 3.81,0; 8 6.35,0; 9 8.89,0; 10 11.43,0
22-23-2041 = drill 1 long: 1 -3.81,0; 2 -1.27,0; 3 1.27,0; 4 3.81,0
JP1 = drill 0.914 long: 1 0,-1.27; 2 0,1.27
FE20 = drill 0.813 long: 1 -24.13,0; 2 -21.59,0; 3 -19.05,0; 4 -16.51,0; 5 -13.97,0; 6 -11.43,0; 7 -8.89,0; 8 -6.35,0; 9 -3.81,0; 10 -1.27,0; 11 1.27,0; 12 3.81,0; 13 6.35,0; 14 8.89,0; 15 11.43,0; 16 13.97,0; 17 16.51,0; 18 19.05,0; 19 21.59,0; 20 24.13,0
TC26H = drill 0.813: 1 -1.27,0; 2 1.27,0
TQFP64_10X10MC = smd 1.473 x 0.279: 1 -5.613,3.75; 2 -5.613,3.25; 3 -5.613,2.75; 4 -5.613,2.25; 5 -5.613,1.75; 6 -5.613,1.25; 7 -5.613,0.75; 8 -5.613,0.25; 9 -5.613,-0.25; 10 -5.613,-0.75; 11 -5.613,-1.25; 12 -5.613,-1.75; 13 -5.613,-2.25; 14 -5.613,-2.75; 15 -5.613,-3.25; 16 -5.613,-3.75; 33 5.613,-3.75; 34 5.613,-3.25; 35 5.613,-2.75; 36 5.613,-2.25; 37 5.613,-1.75; 38 5.613,-1.25; 39 5.613,-0.75; 40 5.613,-0.25; 41 5.613,0.25; 42 5.613,0.75; 43 5.613,1.25; 44 5.613,1.75; 45 5.613,2.25; 46 5.613,2.75; 47 5.613,3.25; 48 5.613,3.75 | smd 0.279 x 1.473: 17 -3.75,-5.613; 18 -3.25,-5.613; 19 -2.75,-5.613; 20 -2.25,-5.613; 21 -1.75,-5.613; 22 -1.25,-5.613; 23 -0.75,-5.613; 24 -0.25,-5.613; 25 0.25,-5.613; 26 0.75,-5.613; 27 1.25,-5.613; 28 1.75,-5.613; 29 2.25,-5.613; 30 2.75,-5.613; 31 3.25,-5.613; 32 3.75,-5.613; 49 3.75,5.613; 50 3.25,5.613; 51 2.75,5.613; 52 2.25,5.613; 53 1.75,5.613; 54 1.25,5.613; 55 0.75,5.613; 56 0.25,5.613; 57 -0.25,5.613; 58 -0.75,5.613; 59 -1.25,5.613; 60 -1.75,5.613; 61 -2.25,5.613; 62 -2.75,5.613; 63 -3.25,5.613; 64 -3.75,5.613
TO220BV = drill 1.016 long: D 0,-2.54; G -2.54,-2.54; S 2.54,-2.54
R0603 = smd 1 x 1.1: 1 -0.85,0; 2 0.85,0
DIL20 = drill 0.813 long: 1 -11.43,-3.81; 2 -8.89,-3.81; 3 -6.35,-3.81; 4 -3.81,-3.81; 5 -1.27,-3.81; 6 1.27,-3.81; 7 3.81,-3.81; 8 6.35,-3.81; 9 8.89,-3.81; 10 11.43,-3.81; 11 11.43,3.81; 12 8.89,3.81; 13 6.35,3.81; 14 3.81,3.81; 15 1.27,3.81; 16 -1.27,3.81; 17 -3.81,3.81; 18 -6.35,3.81; 19 -8.89,3.81; 20 -11.43,3.81
DIL08 = drill 0.813 long: 1 -3.81,-3.81; 2 -1.27,-3.81; 3 1.27,-3.81; 4 3.81,-3.81; 5 3.81,3.81; 6 1.27,3.81; 7 -1.27,3.81; 8 -3.81,3.81
282837-3 = drill 1.27 pad 2.032: 1 0,0; 2 5.08,0; 3 10.16,0
3,0 = hole 3: 0,0
CON4_SMT-RA_FCC-FPC2 = smd 0.61 x 2.007: 1 1.5,3.708; 2 0.5,3.708; 3 -0.5,3.708; 4 -1.5,3.708 | smd 2.667 x 3.607: 5 -4.483,6.515; 6 4.483,6.515

### Placement (x,y rotation side)
+  54.62,26.41 180 top
,  34.15,26.41 180 top
-  13.86,26.45 180 top
--  18.93,26.45 180 top
---  2.85,33.02 270 top
.  29.05,26.43 180 top
..  49.52,26.44 180 top
<  44.41,26.41 180 top
>  39.35,26.36 180 top
`  23.96,26.41 180 top
BRIGHTNESS  96.3,65.05 0 top
C1  13.36,36.08 0 bottom
C2  39.75,37.25 180 bottom
C3  39.75,42.12 180 bottom
C4  36,41.06 270 bottom
C5  36,38 90 bottom
C6  47.73,29.72 0 top
C7  39.75,39.5 0 bottom
C8  47.73,33.41 0 top
C9  89.88,58.12 0 bottom
C10  84.5,56 0 bottom
C11  79,56 0 bottom
C12  73.75,56 0 bottom
C13  68.5,56 0 bottom
C14  63.5,56 180 top
C15  58.5,56 180 top
C16  53.5,56.12 180 top
C17  49,56.12 180 top
C18  43.38,56 180 top
C19  37.62,56.12 180 top
C20  31.62,56.12 180 top
C21  26.38,56.12 180 top
C22  22.25,56.12 180 top
C23  16.62,56.12 180 top
C24  6.5,43.05 180 top
C25  11.8,43.17 180 top
CONTRAST  2.54,19.33 180 top
D1  84.4,58 0 bottom
D2  78.9,58.05 0 bottom
D3  73.7,57.95 0 bottom
D4  68.35,58 0 bottom
D5  63.6,58 180 top
D6  58.4,58 180 top
D7  53.4,58 180 top
D8  49,58 180 top
D9  43.4,58 180 top
D10  37.6,58 180 top
D11  31.64,58.08 180 top
D12  26.4,57.95 180 top
D13  22.25,58.05 180 top
D14  16.55,57.9 180 top
DR1  65.5,32.5 0 top
DR2  65.5,36.25 0 top
DR3  65.5,40 0 top
INPUTS-1  3.35,67.25 90 top
INPUTS-2  35.4,76.5 0 top
INPUTS-3  53.5,76.5 0 top
INPUTS-4  79,76.5 0 top
JP1  12.86,38.66 270 top
LCDHEADER  62,9.5 0 top
LED1  69.94,26.36 180 top
LED2  64.73,26.41 180 top
LED3  82.97,26.36 180 top
LED4  78.89,26.36 180 top
LED5  74.36,26.36 180 top
OSC  44.55,31.62 90 bottom
OUTPUTS-1  24.5,3.5 180 top
OUTPUTS-2  50,3.5 180 top
OUTPUTS-3  75.5,3.5 180 top
P  38,39 270 top
POWER  93.55,3.5 180 top
Q1  79.75,35.5 0 top
Q2  79.67,43.02 0 top
Q3  79.75,50.75 0 top
R1  8.11,36.47 0 bottom
R2  8.12,39.25 180 bottom
R3  90,71.5 0 top
R4  85,71.5 0 top
R5  80,71.5 0 top
R6  75,71.5 0 top
R7  70,71.5 0 top
R8  87.12,54.75 90 bottom
R9  84.5,53.5 180 bottom
R10  81.62,54.38 90 bottom
R11  79,53.5 180 bottom
R12  76.38,54.5 90 bottom
R13  73.75,53.5 180 bottom
R14  71.1,54.55 90 bottom
R15  68.5,53.5 180 bottom
R16  65,71.5 0 top
R17  60,71.5 0 top
R18  55,71.5 0 top
R19  49.5,71.5 0 top
R20  44,71.5 0 top
R21  65.15,51.27 0 top
R22  63.5,53.5 0 top
R23  60.15,51.27 0 top
R24  58.5,53.5 0 top
R25  55,51.4 0 top
R26  53.5,53.62 0 top
R27  50.27,51.4 0 top
R28  49.12,53.62 0 top
R29  46,52.88 270 top
R30  43.38,53.5 0 top
R31  39.37,71.62 0 top
R32  34.29,71.62 0 top
R33  29.21,71.62 0 top
R34  24.13,71.62 0 top
R35  19.05,71.62 0 top
R36  12.56,58.78 90 top
R37  7.64,57.55 90 top
R38  40.25,52.88 270 top
R39  37.62,53.62 0 top
R40  34.25,52.88 270 top
R41  31.62,53.62 0 top
R42  26.88,51 270 top
R43  26.38,53.62 0 top
R44  22.75,51 270 top
R45  22.25,53.62 0 top
R46  16.62,51 180 top
R47  16.62,53.62 0 top
R48  9.13,42.26 270 top
R49  15.78,44.08 90 top
R50  90,55.75 0 bottom
R51  71,32.5 0 top
R52  71,30.25 0 top
R53  71,38 0 top
R54  71,35.75 0 top
R55  71,43.5 0 top
R56  71,41.25 0 top
R57  60.5,32.5 0 top
R58  60.5,36.25 0 top
R59  60.5,40 0 top
R60  79.65,27.85 0 top
R100  13.09,24.21 270 top
R101  15.5,24.21 270 top
R102  18.16,24.21 270 top
R103  20.7,24.21 270 top
R104  23.25,24.21 270 top
R105  25.79,24.21 270 top
R106  28.32,24.21 270 top
R107  30.86,24.21 270 top
R108  33.41,24.21 270 top
R109  35.95,24.21 270 top
R110  38.61,24.21 270 top
R111  41.15,24.21 270 top
R112  43.69,24.21 270 top
R113  46.23,24.21 270 top
R114  48.77,24.21 270 top
R115  51.31,24.21 270 top
R116  53.85,24.21 270 top
R117  56.39,24.21 270 top
R118  58.93,24.21 270 top
R119  61.47,24.21 270 top
R120  64.01,24.21 270 top
R121  66.55,24.21 270 top
R122  69.22,24.21 270 top
R123  71.36,24.21 270 top
R124  73.69,24.21 270 top
R125  75.83,24.21 270 top
R126  78.17,24.21 270 top
R127  80.31,24.21 270 top
R128  82.7,24.21 270 top
R129  84.8,24.21 270 top
SOC1  78.74,64.77 180 top
SOC2  53.34,64.77 180 top
SOC3  27.94,64.77 180 top
SOC4  8.89,49.44 180 top
SOC5  24.5,17 180 top
SOC6  50,17 180 top
SOC7  75.5,17 180 top
TERM1  90.75,37.05 270 top
TERM2  90.75,52.65 270 top
U$5  [3,0]  97.5,10 0 top
U$6  [3,0]  9.5,10 0 top
U$7  [3,0]  97.5,75 0 top
U$8  [3,0]  9.5,75 0 top
ZIF1  22.9,70.8 0 bottom
~  59.65,26.41 180 top

### Tracks (layer width: path | path; a pad name or v marks a point on that pad's centre or on a via)
MCLR  (via drill 0.6)
  Top 0.254: 39.04,43.46 38.75,43.73 | P.7
  Top 0.305: v44,43.75 43.73,43.45 39.04,43.46 | 38.75,43.73 P.7
  Bottom 0.254: 43.71,43.44 v44,43.75 43.7,43.45 31.35,43.45 28.9,41 7.9,41 7.28,40.38 R2.1 | 7.17,39.37 ---.1
  Bottom 0.406: R2.1 7.17,39.37
N$1
  Top 0.254: 5.05,53.28 SOC4.4
  Top 0.305: INPUTS-1.1 4.63,55.82 5.05,55.4 5.05,53.28
N$3
  Top 0.254: R101.2 15.5,20.92 SOC5.9
N$4
  Bottom 0.254: JP1.1 9.02,38.66 | 9.02,38.66 R2.2 | 9.02,38.66 8.96,38.66 R1.1
N$5
  Top 0.254: 7.6,58.36 R37.2
  Top 0.305: INPUTS-1.2 7.6,58.36
N$6
  Top 0.254: R103.2 20.7,20.82 SOC5.7
N$7
  Top 0.305: SOC4.2 10.16,59.69 8.95,60.9 INPUTS-1.3
N$8
  Top 0.254: SOC5.5 25.77,23.35 R105.2
N$11
  Top 0.254: INPUTS-1.4
  Top 0.305: R36.2 12.56,62.19 11.3,63.45 INPUTS-1.4
N$13
  Top 0.254: R107.2 30.86,20.82 SOC5.3
N$17
  Bottom 0.254: INPUTS-1.5 6.73,65.98 9.3,68.55 16.48,68.55 SOC3.10
N$19
  Top 0.305: R36.1 12.56,53.39 SOC4.1
  Bottom 0.254: ZIF1.3 23.4,70.5 22.95,70.05 22.95,66.15 22.15,65.35 14.7,65.35 14,64.65 14,54.55 SOC4.1
N$20
  Bottom 0.254: 14.13,36.08 JP1.2
  Bottom 0.406: C1.1 14.13,36.08
N$21
  Top 0.254: 7.64,53.27 SOC4.3
  Top 0.305: R37.1 7.64,53.27
  Bottom 0.254: ZIF1.2 22.4,71.9 20.35,69.85 20.35,67.35 19.4,66.4 8.85,66.4 7.65,65.2 7.65,53.28 SOC4.3
N$23  (via drill 0.6)
  Top 0.254: R35.2 19.9,72.65 19.3,73.25 v15.45,73.25
  Bottom 0.254: INPUTS-1.6 5.28,70.45 14.4,70.45 15.45,71.5 v15.45,73.25
N$24
  Top 0.254: SOC3.8 21.59,67.04 20.65,66.1 8.31,66.1 INPUTS-1.7
N$25
  Top 0.254: INPUTS-1.8 3.4,73.6 6.6,70.4 13.35,70.4 14.5,71.55 14.5,73.8 15.1,74.4 24.45,74.4 25,73.85 25,71.64 R34.2
N$26
  Bottom 0.254: SOC3.6 26.67,74.28 21.4,79.55 6.76,79.55 INPUTS-1.9
N$27
  Top 0.254: R109.2 35.95,20.82 SOC5.1
N$28
  Top 0.254: R33.2 30.06,78.09 28.65,79.5 4.17,79.5 INPUTS-1.10
N$29
  Top 0.254: SOC3.4 31.75,76.34 INPUTS-2.1
N$30
  Top 0.254: R32.2 35.14,75.49 INPUTS-2.2
N$31
  Top 0.254: SOC3.2 36.83,76.34 INPUTS-2.3
N$32
  Top 0.254: R31.2 40.22,75.49 INPUTS-2.4
N$33
  Top 0.305: DR2.4 69.7,35.3 R54.1
N$34
  Top 0.305: DR2.6 69.35,37.2 R53.1
N$35
  Top 0.305: DR1.4 66.75,31.55 66.75,31.5 68.9,31.5 R52.1
N$36
  Top 0.254: 13.09,26.73 -.A 13.11,25.07 R100.1
N$37
  Top 0.254: R102.1 18.18,25.07 --.A
N$38
  Top 0.254: R104.1 23.21,25.07 `.A
N$39
  Top 0.254: R106.1 28.3,25.07 ..A
N$40
  Top 0.254: R108.1 ,.A
N$41
  Top 0.305: DR1.6 69.2,33.45 R51.1
N$42
  Top 0.254: 38.63,25.09 R110.1 >.A
N$43
  Top 0.254: R111.2 41.15,20.85 SOC6.9
N$44
  Top 0.406: SOC1.6 77.47,76.24 INPUTS-4.5
N$45
  Top 0.406: INPUTS-4.4 75.19,72.16 R6.2
N$46
  Top 0.61: Q3.D 79.75,46.4 80.5,45.65 83.75,45.65 TERM2.1
N$47
  Top 0.254: R113.2 46.23,20.85 SOC6.7
N$48
  Top 0.305: R52.2 R51.2 76.75,32.5 Q1.G
N$49
  Top 0.254: R115.2 51.31,20.85 SOC6.5
N$50
  Top 0.305: R54.2 R53.2 74.65,38 Q2.G
N$51
  Top 0.254: SOC6.3 56.35,23.32 R117.2
N$52
  Top 0.305: DR3.4 67.95,39.05 R56.1
N$53
  Top 0.254: R119.2 61.47,20.85 SOC6.1
N$54
  Top 0.406: SOC1.7 74.93,70.72 R6.1
N$55
  Top 0.254: R118.1 58.9,25.07 ~.A
N$56
  Top 0.254: R116.1 53.87,25.07 +.A
N$57
  Top 0.254: R114.1 ...A
N$58
  Top 0.254: R112.1 43.66,25.07 <.A
N$59
  Top 0.305: DR3.6 67.6,40.95 R55.1
N$60
  Top 0.254: SOC7.9 66.61,23.3 R121.2
N$61
  Top 0.305: R56.2 R55.2 72.5,43.5 Q3.G
N$62
  Top 0.254: SOC7.7 71.69,23.03 R123.2
N$63  (via drill 0.6)
  Top 0.254: POWER.2 94.82,5.68 91,9.5 v88.65,9.5
  Bottom 0.254: LCDHEADER.20 v88.65,9.5
N$64
  Top 0.254: SOC7.5 76.77,22.43 R125.2
N$65
  Top 0.61: Q2.D 79.67,43.12 80.5,43.95 89.29,43.95 TERM2.3
N$66
  Top 0.254: SOC7.3 81.85,21.83 R127.2
N$68
  Top 0.254: R129.2 84.8,22.95 SOC7.1
N$69
  Top 0.254: R128.1 82.7,25.88 LED3.A
N$70
  Top 0.254: R126.1 78.17,26.32 LED4.A
N$71
  Top 0.254: R124.1 73.69,26.27 LED5.A
N$72
  Top 0.254: R122.1 69.19,25.07 LED1.A
N$73
  Top 0.254: R120.1 63.98,25.07 LED2.A
N$74
  Top 0.61: Q1.D 79.75,31.7 80.75,30.7 89.48,30.7 TERM1.2
N$75
  Bottom 0.254: LCDHEADER.19 83.59,7.46 83.51,7.46 83.1,7.05 83.1,2.2 83.7,1.6 90.5,1.6 91,2.1 91,10.5 98.25,17.75 98.25,60.56 BRIGHTNESS.1
N$76
  Bottom 0.254: BRIGHTNESS.3 BRIGHTNESS.2 98.8,62.55 98.8,17.3 92.95,11.45 92.95,7.55 94.9,5.6 97.35,5.6 97.36,5.59 POWER.1
N$77
  Top 0.254: R57.2 DR1.2
N$78
  Top 0.254: R58.2 DR2.2
N$79
  Top 0.254: R59.2 DR3.2
N$80
  Top 0.254: P.55 54.75,38.25 56.75,36.25 R58.1
N$81
  Top 0.254: P.58 59.4,39.75 R59.1
N$84
  Top 0.406: SOC3.9 19.05,70.77 R35.1
  Bottom 0.254: ZIF1.1 21.4,72 19.05,69.65 SOC3.9
N$87
  Top 0.406: SOC3.7 24.13,70.77 R34.1
  Bottom 0.254: ZIF1.4 24.4,68.85 SOC3.7
N$90
  Top 0.406: SOC3.5 29.21,70.77 R33.1
N$93
  Top 0.406: SOC3.3 34.29,70.77 R32.1
N$95
  Top 0.406: SOC3.1 39.37,70.77 R31.1
N$96
  Top 0.406: SOC2.10 41.91,76.34 INPUTS-3.1
N$98
  Top 0.406: SOC2.9 44.45,70.2 R20.1
N$99
  Top 0.406: SOC2.8 46.99,76.34 INPUTS-3.3
N$100
  Top 0.406: INPUTS-3.2 44.61,71.74 R20.2
N$101
  Top 0.406: INPUTS-3.4 49.69,72.16 R19.2
N$102
  Top 0.406: SOC2.6 52.07,76.34 INPUTS-3.5
N$103
  Top 0.406: SOC2.7 49.53,70.62 R19.1
N$104
  Top 0.406: SOC2.4 57.15,76.34 INPUTS-3.7
N$105
  Top 0.406: SOC2.3 59.69,70.96 R17.1
N$106
  Top 0.406: INPUTS-3.8 59.85,72.5 R17.2
N$107
  Top 0.406: SOC2.2 62.23,76.34 INPUTS-3.9
N$108
  Top 0.406: SOC2.1 64.77,70.88 R16.1
N$109
  Top 0.406: INPUTS-3.10 64.93,72.42 R16.2
N$110
  Top 0.406: SOC1.10 67.31,76.24 INPUTS-4.1
N$111
  Top 0.406: INPUTS-4.2 70.11,72.24 R7.2
N$112
  Top 0.406: SOC1.9 69.85,70.8 R7.1
N$113
  Top 0.406: SOC1.8 72.39,76.24 INPUTS-4.3
N$114
  Top 0.406: SOC2.5 54.61,71.04 R18.1
N$115
  Top 0.406: INPUTS-3.6 54.77,72.58 R18.2
N$116
  Top 0.406: INPUTS-4.6 80.27,72.08 R5.2
N$117
  Top 0.406: SOC1.5 80.01,70.64 R5.1
N$118
  Top 0.406: SOC1.4 82.55,76.24 INPUTS-4.7
N$119
  Top 0.406: INPUTS-4.8 85.35,72 R4.2
N$120
  Top 0.406: SOC1.3 85.09,70.56 R4.1
N$121
  Top 0.406: SOC1.2 87.63,76.24 INPUTS-4.9
N$122
  Top 0.406: INPUTS-4.10 90.43,71.92 R3.2
N$123
  Top 0.406: SOC1.1 90.17,70.48 R3.1
N$149
  Top 0.254: LCDHEADER.3 42.5,9.95 42.5,14.62 39,18.12 3.75,18.12 CONTRAST.2
N$151
  Bottom 0.254: CONTRAST.3 2.53,6.66 3.75,5.4 80.35,5.4 81.05,6.1 LCDHEADER.18
OUT
  Top 0.254: R60.2 83.2,27.85 83.7,27.35 83.7,26.38 LED3.C 84.39,26.36 84.8,25.95 R129.1
OUT1-1
  Top 0.61: OUTPUTS-1.10 14.25,4.68 14.25,12.25 13.31,13.19 SOC5.11
OUT1-2
  Top 0.61: SOC5.12 OUTPUTS-1.9
OUT2-1
  Top 0.61: SOC5.13 OUTPUTS-1.8
OUT2-2
  Top 0.61: SOC5.14 OUTPUTS-1.7
OUT3-1
  Top 0.61: SOC5.15 OUTPUTS-1.6
OUT3-2
  Top 0.61: SOC5.16 OUTPUTS-1.5
OUT4-1
  Top 0.61: SOC5.17 OUTPUTS-1.4
OUT4-2
  Top 0.61: SOC5.18 OUTPUTS-1.3
OUT5-1
  Top 0.61: SOC5.19 OUTPUTS-1.2
OUT5-2
  Top 0.61: SOC5.20 34.75,11.75 34.75,5 OUTPUTS-1.1
OUT6-1
  Top 0.61: SOC6.11 39.12,12.63 39.12,4 38.62,3.5 OUTPUTS-2.10
OUT6-2
  Top 0.61: SOC6.12 41.75,12.55 41.75,4.25 41.11,3.61 OUTPUTS-2.9
OUT7-1
  Top 0.61: OUTPUTS-2.8 44.25,4.1 44.25,12.5 43.65,13.1 SOC6.13
OUT7-2
  Top 0.61: OUTPUTS-2.7 46.75,4.06 46.75,12.62 SOC6.14
OUT8-1
  Top 0.61: OUTPUTS-2.6 49.25,4.02 49.25,12.62 48.73,13.14 SOC6.15
OUT8-2
  Top 0.61: OUTPUTS-2.5 51.88,4.11 51.88,12.62 51.31,13.19 SOC6.16
OUT9-1
  Top 0.61: OUTPUTS-2.4 54.38,4.07 54.38,12.62 SOC6.17
OUT9-2
  Top 0.61: OUTPUTS-2.3 56.88,4.03 56.88,12.5 56.35,13.03 SOC6.18
OUT10-1
  Top 0.61: OUTPUTS-2.2 59.5,4.11 59.5,12.62 58.94,13.19 SOC6.19
OUT10-2
  Top 0.61: OUTPUTS-2.1 62,4.07 62,12.62 SOC6.20
OUT11-1
  Top 0.61: OUTPUTS-3.10 64.5,3.93 64.5,12.75 SOC7.11
OUT11-2
  Top 0.61: OUTPUTS-3.9 67.12,4.01 67.12,12.62 66.61,13.14 SOC7.12
OUT12-1
  Top 0.61: OUTPUTS-3.8 69.62,3.98 69.62,12.62 69.15,13.1 SOC7.13
OUT12-2
  Top 0.61: OUTPUTS-3.7 72.12,3.94 72.12,12.75 SOC7.14
OUT13-1
  Top 0.61: OUTPUTS-3.6 74.75,4.02 74.75,12.75 74.31,13.19 SOC7.15
OUT13-2
  Top 0.61: OUTPUTS-3.5 77.25,3.98 77.25,12.75 76.81,13.19 SOC7.16
OUT14-1
  Top 0.61: OUTPUTS-3.4 79.75,3.94 79.75,12.75 SOC7.17
OUT14-2
  Top 0.61: OUTPUTS-3.3 82.38,4.03 82.38,12.75 81.94,13.19 SOC7.18
OUT15-1
  Top 0.61: OUTPUTS-3.2 84.88,3.98 84.88,12.75 84.44,13.19 SOC7.19
OUT15-2
  Top 0.61: OUTPUTS-3.1 87.5,4.07 87.5,12.62 SOC7.20
PGEC1  (via drill 0.6)
  Top 0.254: P.15 34.75,45.75 34.35,46.15 33.02,46.15 v33,46.12
  Bottom 0.254: ---.5 1.26,29.21 0.44,30.15 0.44,40.54 1.9,42 28.25,42 32.4,46.15 32.98,46.15 v33,46.12
PGECD  (via drill 0.6)
  Top 0.254: P.16 33.91,44.95 v33.2,44.95
  Bottom 0.254: ---.4 0.9,33.7 0.9,40.35 2.05,41.5 28.6,41.5 31.3,44.15 32.4,44.15 v33.2,44.95
PIN1
  Top 0.254: P.1 41.75,45.25 42.1,45.6 66.25,45.6 69.55,49.2 69.55,55.7 70.75,56.8 96.35,56.8 96.95,56.2 96.95,17.25 96.6,16.9 66.95,16.9 65.4,15.35 65.4,11.9 65.81,11.49 LCDHEADER.12
PIN2
  Top 0.254: P.2 41.25,45.8 41.55,46.1 66,46.1 69.05,49.35 69.05,55.95 70.5,57.3 96.75,57.3 97.45,56.6 97.45,16.85 97,16.4 69.35,16.4 67.9,14.95 67.9,11.95 68.35,11.55 LCDHEADER.13
PIN3
  Top 0.254: P.3 40.75,46.25 41.1,46.6 65.65,46.6 68.55,49.55 68.55,56.2 70.3,57.8 97.1,57.8 98,56.9 98,16.5 97.35,15.85 71.5,15.85 70.4,14.65 70.4,12 70.9,11.55 LCDHEADER.14
PIN4
  Top 0.254: P.4 40.25,46.6 40.75,47.1 65.4,47.1 68.05,49.8 68.05,56.45 70.1,58.3 97.4,58.3 98.5,57.25 98.5,16.1 97.7,15.35 74.05,15.35 73,14.3 73,11.85 73.45,11.4 73.45,9.52 LCDHEADER.15
PIN5
  Top 0.254: P.5 39.75,47 40.35,47.6 65.2,47.6 67.55,49.95 67.55,56.7 69.9,58.8 97.7,58.8 99,57.55 99.05,57.5 99.05,15.75 98.15,14.85 76.35,14.85 75.55,14.05 75.55,11.8 75.95,11.4 75.95,9.52 LCDHEADER.16
PIN6  (via drill 0.6)
  Top 0.254: P.6 39.25,47.4 39.95,48.1 65,48.1 67.05,50.15 67.05,56.9 69.7,59.3 97.95,59.3 99.6,57.75 99.6,15.4 98.55,14.35 89.65,14.35 88.75,13.45 v88.75,11.85
  Bottom 0.254: LCDHEADER.17 78.51,10.96 79,11.45 88.35,11.45 v88.75,11.85
PIN8  (via drill 0.6)
  Top 0.254: P.8 v38.25,46.12 | v38.25,46.12 | v38.25,46.12
  Bottom 0.254: v38.25,46.12 38.38,46.25 66.3,46.25 70.65,50.6 84.55,50.6 | R50.1 90.72,55.88
  Bottom 0.305: 90.72,55.88 C9.1 90.17,58.68 SOC1.20 | 84.55,50.6 86.8,52.85 87.95,52.85 R50.1
PIN11  (via drill 0.6)
  Top 0.254: P.11 36.75,46 38,47.25 v38.25,47.25
  Bottom 0.254: R9.2 85.75,53.9 | v38.25,47.25 66.6,47.25 70.45,51.1 84.05,51.1
  Bottom 0.305: 85.75,53.9 R8.1 | 84.05,51.1 85.35,52.4 R9.2 C10.1 85.33,56 D1.1 85.33,60.72 SOC1.18
PIN12  (via drill 0.6)
  Top 0.254: P.12 36.25,47 v36.75,47.5
  Bottom 0.254: v36.75,47.5 37.38,48.12 66.72,48.12 70.3,51.7 79.15,51.7 | 79.88,53.52 R11.2 | 79.88,55.98 C11.1
  Bottom 0.305: R10.1 79.88,53.52 79.88,55.98 | 79.15,51.7 79.85,52.4 R11.2 | SOC1.16 79.83,60.78 D2.1 79.83,56.02 C11.1
PIN13  (via drill 0.6)
  Top 0.254: P.13 35.75,47.05 v35.35,47.5
  Bottom 0.254: v35.35,47.5 36.38,48.62 66.42,48.62 70.05,52.25 | R12.1 74.95,53.65 R13.2
  Bottom 0.305: 70.05,52.25 74.15,52.25 74.6,52.7 R13.2 C12.1 74.63,56.03 D3.1 74.63,60.66 SOC1.14
PIN14  (via drill 0.6)
  Top 0.254: P.14 35.25,45.95 v33.85,47.35
  Bottom 0.254: v33.85,47.35 35.55,49.12 66.03,49.12 69.35,52.45 | R15.2 69.6,53.73
  Bottom 0.305: 69.6,53.73 R14.1 | 69.35,52.45 R15.2 C13.1 69.35,57.93 D4.1 69.28,60.39 SOC1.12
PIN17
  Top 0.254: C14.1 R22.2 | 64.62,53.69 R22.2 | R22.2 64.3,53.45 R21.1 64.28,51.25 | P.17 31.3,42.75 31,43.05 31,45.9 33.7,48.6 60.65,48.6 63.3,51.25
  Top 0.305: 63.3,51.25 64.28,51.25 | SOC2.20 64.77,58.24 D5.1 64.53,56.18 C14.1
PIN18
  Top 0.254: 59.3,53.45 R24.2 | P.18 31,42.25 30.5,42.75 30.5,46.15 33.45,49.1 58.35,49.1 59.35,50.1 59.35,51.23 R23.1
  Top 0.305: R23.1 59.3,53.45 | SOC2.18 59.69,58.36 D6.1 59.33,56.02 C15.1 R24.2
PIN21
  Top 0.254: P.21 30.85,40.75 30,41.6 30,46.4 33.2,49.6 53.35,49.6
  Top 0.305: 53.35,49.6 54.15,50.4 R25.1 54.15,52.5 54.35,52.7 R26.2 C16.1 54.33,56.15 D7.1 54.61,58.28 SOC2.16
PIN22
  Top 0.254: 49.58,53.59 R28.2 49.85,53.75 C17.1 | P.22 30.55,40.25 29.5,41.3 29.5,46.65 32.95,50.1 49,50.1 | 49.45,51.38 R27.1
  Top 0.305: 49,50.1 49.45,50.55 49.45,51.38 | C17.1 49.93,56.2 D8.1 49.93,60.56 SOC2.14 | R27.1 49.42,53.08 R28.2
PIN23
  Top 0.254: R30.2 44.45,53.74 | 43.67,50.62 32.75,50.62 29,46.88 29,41 30.25,39.75 P.23 | P.23
  Top 0.305: 44.45,53.74 R29.1 | 43.67,50.62 44.23,51.17 R30.2 C18.1 44.33,56.1 D9.1 44.45,58.12 SOC2.12
PIN24
  Top 0.254: P.24 30,39.25 28.5,40.75 28.5,47.12 32.5,51.12 37.88,51.12 | P.24 | 38.5,53.6 R39.2 | 39.9,53.62 R38.1
  Top 0.305: 37.88,51.12 38.5,51.75 38.5,53.6 | 39.9,53.62 R39.2 C19.1 38.53,56.18 D10.1 39.37,58.84 SOC3.20
PIN27
  Top 0.254: 32.5,51.88 28,47.38 28,40.5 30.75,37.75 P.27 | P.27 | 32.5,53.6 R41.2 | 34.23,54 R40.1 | D11.1 32.48,57.98
  Top 0.305: 32.5,51.88 32.5,53.6 | 34.23,54 33.62,54 33.25,53.62 R41.2 C20.1 32.48,57.98 | SOC3.18 32.56,59.23 D11.1
PIN28
  Top 0.254: P.28 30.5,37.25 27.5,40.25 27.5,44.75 | P.28 | 26.85,51.88 R42.1 | 26.88,53.27 R43.2
  Top 0.305: 27.5,44.75 26.12,46.12 25.38,46.85 25.38,51.38 25.88,51.88 26.85,51.88 | R42.1 26.88,53.27 | R43.2 C21.1 27.33,56.23 D12.1 27.33,59.08 SOC3.16
PIN29
  Top 0.254: P.29 30.25,36.75 27,40 27,44.5 | P.29 | R44.1 23.1,52.2
  Top 0.305: 23.1,52.2 R45.2 C22.1 23.18,56.2 D13.1 23.18,60.01 SOC3.14 | R44.1 23.52,51.85 24,51.42 24,47.5 27,44.5
PIN30
  Top 0.254: P.30 30,36.25 26.5,39.75 26.5,42.8 25.55,43.75 18.3,43.75 | P.30 | 17.5,50.98 R46.1
  Top 0.305: R46.1 R47.2 C23.1 D14.1 17.48,59.39 SOC3.12 | 18.3,43.75 17.5,44.55 17.5,50.98
PIN31
  Top 0.254: 29.75,35.75 26,39.5 26,42.65 25.43,43.23 R49.1 15.55,43.17 | C25.1 12.7,43.22 | P.31
  Top 0.305: 29.75,35.75 P.31 | C25.1 15.55,43.17 | 12.7,43.22 SOC4.8
PIN32
  Top 0.254: 7.42,43.1 C24.1 7.62,43.31 | P.32 | P.32 10.55,35.25 | 9.14,43.1 R48.1
  Top 0.305: R48.1 7.42,43.1 | 10.55,35.25 10.05,35.75 10.05,42.2 9.14,43.1 | 7.62,43.31 SOC4.6
PIN33
  Top 0.254: R101.1 15.5,26.1 15.15,26.45 | 15.15,26.45 -.C | P.33 34.25,29.25 33.95,28.95 17.65,28.95 15.15,26.45
PIN34
  Top 0.254: R103.1 20.7,25.95 20.2,26.45 | 20.2,26.45 --.C | P.34 34.75,28.9 34.3,28.45 22.2,28.45 20.2,26.45
PIN36
  Top 0.254: `.C 25.45,26.41 | 25.45,26.41 25.8,26.05 R105.1 | P.36 35.75,28.3 35.35,27.9 26.94,27.9 25.45,26.41
PIN37
  Top 0.254: R107.1 30.86,26.14 30.55,26.45 | 30.55,26.45 29.82,26.45 ..C | P.37 36.25,27.95 35.55,27.25 31.35,27.25 30.55,26.45
PIN39
  Top 0.254: P.39 37.25,27.7 35.95,26.4 | 35.95,26.4 R109.1 | ,.C 35.95,26.41 35.95,26.4
PIN40
  Top 0.254: R111.1 41.15,25.85 40.65,26.35 >.C 40.1,26.95 39.85,27.2 38.25,27.2 37.75,27.7 P.40
PIN42
  Top 0.254: LCDHEADER.4 45.49,11.51 45.12,11.88 45.12,15.1 42.12,18.1 42.12,25.8 38.75,29.1 38.75,33.26 P.42
PIN43
  Top 0.254: P.43 39.25,29.5 42.65,26.05 42.65,18.7 47.4,14.25 47.4,10.13 LCDHEADER.5
PIN44  (via drill 0.6)
  Top 0.254: v39.75,34.88 | v39.75,34.88
  Top 0.305: P.44 v39.75,34.88
  Bottom 0.254: LCDHEADER.6 50.57,11.7 50.62,11.75 50,12.38 50,14.85 48.75,16.1 40.65,16.1 40.62,16.12 40.31,16.44 39.75,17 v39.75,34.88
PIN45
  Top 0.254: R113.1 46.23,25.97 45.8,26.4 <.C 45.2,26.45 45.2,27.05 45.05,27.2 42.4,27.2 40.25,29.35 P.45
PIN46
  Top 0.254: R115.1 51.31,25.99 50.85,26.45 ...C 50.25,26.46 50.25,27.1 49.65,27.7 42.7,27.7 40.75,29.65 P.46
PIN49
  Top 0.254: R117.1 56.39,26.01 56,26.4 +.C 55.4,26.43 55.4,27.15 53.8,28.75 53.8,34.65 53.2,35.25 P.49
PIN50
  Top 0.254: R119.1 61.47,25.93 61,26.4 ~.C 60.4,26.95 59.95,27.4 55.85,27.4 54.3,28.95 54.3,34.85 53.4,35.75 P.50
PIN51
  Top 0.254: R121.1 66.55,26 66.15,26.4 LED2.C 65.55,26.48 65.55,26.95 65.25,27.25 60.85,27.25 60.2,27.9 56.1,27.9 54.85,29.15 54.85,35.05 53.65,36.25 P.51
PIN52
  Top 0.254: P.52 53.95,36.75 55.4,35.3 55.4,29.35 56.35,28.4 60.5,28.4 61.1,27.8 69.75,27.8 70.65,26.9 70.65,26.39 LED1.C 71.36,25.68 R123.1
PIN53
  Top 0.254: P.53 54.15,37.25 55.9,35.5 55.9,29.65 56.65,28.9 60.8,28.9 61.4,28.3 74.65,28.3 75.83,27.11 75.83,26.4 | R125.1 75.83,26.4 | LED5.C 75.79,26.36 75.83,26.4
PIN54
  Top 0.254: P.54 54.35,37.75 56.45,35.65 56.45,33.25 | 56.45,33.25 56.45,29.9 56.95,29.4 61.15,29.4 61.7,28.85 78.35,28.85 78.8,28.4 R60.1 | R57.1 57.2,32.5 56.45,33.25
PIN59
  Top 0.254: P.59 45.15,40.25 47.95,43.05 67.55,43.05 72.05,48.05 72.05,54 72.35,54.3 94,54.3 94.2,54.1 94.2,30.15 93.55,29.5 80,29.5 79.65,29.15 LED4.C 80.31,25.68 R127.1 | P.59
PIN60  (via drill 0.6)
  Top 0.254: P.60
  Top 0.305: P.60 v42,40.75
  Bottom 0.254: v42,40.75 42.62,40.12 42.62,17.48 43.48,16.62 50.73,16.62 52.58,14.78 52.58,9.82 52.9,9.5 LCDHEADER.7
PIN61
  Top 0.254: P.61 45.35,41.25 47.65,43.55 67.25,43.55 71.55,48.25 71.55,54.4 72,54.8 94.6,54.8 94.75,54.65 94.75,19.25 94.45,18.95 57.8,18.95 55.25,16.4 55.25,11.9 55.65,11.5 LCDHEADER.8
PIN62
  Top 0.254: P.62 45.1,41.75 47.4,44.05 66.9,44.05 71.05,48.55 71.05,54.8 71.6,55.3 94.95,55.3 95.25,55 95.25,18.7 94.95,18.4 59.65,18.4 57.65,16.35 57.65,11.95 58.2,11.4 LCDHEADER.9
PIN63
  Top 0.254: P.63 44.8,42.25 47.1,44.55 66.7,44.55 70.55,48.75 70.55,55.15 71.2,55.8 95.45,55.8 95.85,55.35 95.85,18.25 95.5,17.9 62.8,17.9 60.3,15.4 60.3,11.9 60.75,11.45 60.75,11.4 60.73,11.38 LCDHEADER.10
PIN64
  Top 0.254: P.64 44.55,42.75 46.85,45.05 66.45,45.05 70.05,49 70.05,55.45 70.95,56.3 95.9,56.3 96.4,55.8 96.4,17.75 96.05,17.4 64.9,17.4 62.85,15.35 62.85,11.85 63.27,11.43 LCDHEADER.11
SOSCI
  Top 0.254: C6.1 46.88,29.62 45.62,29.62 44.62,30.36 OSC.1 42.5,30.35 41.25,31.6 P.47
SOSCO
  Top 0.254: 47.01,33.38 45.12,33.38 OSC.2 43.11,31.45 43.1,31.45 43.05,31.4 42.35,31.4 41.75,32 P.48
  Top 0.406: 47.01,33.38 C8.1
VCAP  (via drill 0.6)
  Top 0.254: 42.5,38.75
  Top 0.305: P.56 42.5,38.75 42.25,39 v41.75,39.5
  Bottom 0.254: C7.1 v41.75,39.5
VDD  (via drill 0.6)
  Top 0.254: LCDHEADER.2 40.38,9.46 40.38,5.5 39.87,5 39.87,0.95 | 5.68,34.45 8.88,34.38 | R42.2 26.98,50.15 27,50.12 | 34.27,52.25 R40.2 | 55.85,62.23 55.88,62.25 | R48.2 7.43,41.41 | 65,37.25 65.5,37.75 65.5,40.5 65.05,40.95 DR3.1 62.8,40.95 62,41.75 49.25,41.75 v48.75,42.25 | 65,37.25 64.33,37.25 DR2.1 | DR1.1 64.95,33.45 65.5,34 65.5,36.75 65,37.25 | 37.6,41.75 v37.25,42.1 | P.10 | P.35 | P.38
  Top 0.305: P.10 v37.25,42.1 | P.19 34.25,41.75 v34.38,42.5 | P.26 34,38.25 34.5,37.75 v35,37.25 | P.35 35.25,37 | P.38 36.75,35.75 | 20.25,62.88 20.25,50.67 20.77,50.15 R44.2 | 20.25,62.88 15.25,62.88 14.62,62.38 14.62,52.15 R46.2 | 35,62.88 29.88,62.88 | 29.88,62.88 20.25,62.88 | 35,62.88 35.5,62.25 35.5,52.88 34.88,52.25 34.27,52.25 | R38.2 41.5,53.15 41.5,55.12 40.62,56 40.62,62.25 40,62.88 | 40,62.88 35,62.88 | R29.2 47.25,53.02 47.25,54.65 45.75,56.12 45.75,62.25 45,62.88 | 45,62.88 40,62.88 | 50.12,62.88 50.75,62.25 50.75,59.88 51.12,59.5 R27.2 | 50.12,62.88 45,62.88 | 55.88,62.25 55.25,62.88 | 55.25,62.88 50.12,62.88 | 60.38,62.88 61,62.25 R23.2 | 60.38,62.88 55.25,62.88 | 65.5,62.88 60.38,62.88 | 65.5,62.88 66,62.38 R21.2 | 29.88,62.88 30.38,62.38 30.38,59.88 28.25,57.75 28.25,50.5 27.88,50.12 27,50.12 | 65.5,62.88 66.88,62.88 v67.38,63.38 | R25.2 55.85,62.23 | 7.43,41.41 ---.2 | R48.2 4.89,41.41 3.85,42.45 3.85,48.65 4.65,49.45 14.22,49.45 R46.2 | R49.2 R46.2 | v42,42.25 41.75,42.25 41.25,41.75 37.6,41.75
  Top 0.406: 35.25,37 v35,37.25 | 36.75,35.75 v37.5,36.75 37.5,41.85 v37.25,42.1 | 92.25,1.88 92.28,1.88
  Top 0.61: 92.25,1.88 91.38,0.97 39.87,0.95 1.88,1 0.75,2.25 0.75,34.88 2.71,36.83 ---.2 3.04,36.83 5.5,34.38 8.88,34.38 33.38,34.38 34.25,35.25 34.25,36.5 v35,37.25 | 92.28,1.88 POWER.3
  Bottom 0.254: C2.1 38.9,37.15 38.25,37.15 38.25,37.25 | 38.9,42.1 C3.1 | C4.1 35.88,41.98 | 35.12,37.15 v35,37.25 | R1.2 3.21,36.47 ---.2 | R10.2 81.25,55.6 | R8.2 87.28,55.75 | v48.75,42.25 v42,42.25
  Bottom 0.305: R14.2 71.12,62.25 70.5,62.88 | R12.2 76.38,62.12 75.5,62.88 | 75.5,62.88 70.5,62.88 | 81.25,55.6 81.25,62.25 80.62,62.88 | 80.62,62.88 75.5,62.88 | R8.2 86.38,56.35 86.38,62.25 85.75,62.88 80.62,62.88 | 87.28,55.75 R50.2 | 70.5,62.88 67.88,62.88 v67.38,63.38
  Bottom 0.406: 38.25,37.15 C5.1 35.12,37.15 | C4.1 v37.25,42.1 38.9,42.1 | 35.88,41.98 v34.38,42.5 | 38.25,37.25 v37.5,36.75
  Bottom 0.61: 3.17,36.47 ---.2
VSS  (via drill 0.6)
  Top 0.254: 34.62,40.38 v34.75,40.5 | 82.58,60.96 SOC1.17 | SOC1.15 | 72.39,61.02 SOC1.13 | 67.33,60.96 SOC1.11 | R22.1 C14.2 | R28.1 48.15,53.75 | 40.5,36.09 v40.5,36.5 | R104.2 23.23,23.35 SOC5.6 | SOC5.4 R106.2 | SOC5.2 33.39,23.35 R108.2 | SOC6.10 38.57,23.32 R110.2 | R112.2 43.65,23.32 SOC6.8 43.75,20.81 45.61,18.95 46.87,18.95 SOC6.6 48.73,23.32 R114.2 | R116.2 53.81,23.32 SOC6.4 | R118.2 58.89,23.32 SOC6.2 | R120.2 64.07,23.3 SOC7.10 | R122.2 69.15,23.3 SOC7.8 | 13.07,23.35 SOC5.10 | R102.2 SOC5.8 | 5.28,43.42 5.08,43.62 | 10.1,45.69 SOC4.7 | DR3.3 64.28,39.03 64.25,39 61,39 60.5,38.5 60.5,35.25 | 60.5,35.25 64.23,35.25 DR2.3 | 60.5,35.25 60.5,31.75 60.7,31.55 DR1.3 64.28,31.53 64.25,31.5 63.5,31.5 v62.5,30.5 | R128.2 82.7,22.5 SOC7.2 | SOC7.4 79.31,22.23 R126.2 | SOC7.6 74.23,22.83 R124.2 | D11.2 30.77,58.01 | P.9 | 33.75,38.75 | P.41
  Top 0.305: P.9 37.75,42.94 40.5,42.94 v40.5,42.62 | P.20 34,41.25 34.38,40.88 | C8.2 48.58,34.3 48.5,34.38 | P.25 33.75,38.75 34.62,39.62 | SOC1.19 85.72,62.88 84.5,62.88 82.58,60.96 | SOC1.17 80.64,62.88 79.38,62.88 SOC1.15 75.56,62.88 74.25,62.88 72.39,61.02 | SOC1.13 70.47,62.88 69.25,62.88 67.33,60.96 | R26.1 C16.2 52.47,56.3 D7.2 52.07,58.4 SOC2.15 | 48.15,53.75 C17.2 48.07,56.2 D8.2 46.99,59.08 SOC2.13 | R30.1 C18.2 42.47,56.05 D9.2 41.91,58.56 SOC2.11 | R39.1 C19.2 36.67,56.23 D10.2 36.83,58.16 SOC3.19 | C24.2 5.28,43.42 | R47.1 C23.2 15.62,56.28 D14.2 15.62,60.07 SOC3.11 | R45.1 C22.2 21.32,56.2 D13.2 21.32,60.69 SOC3.13 | R43.1 C21.2 25.52,57.9 D12.2 25.47,59.76 SOC3.15 | R41.1 C20.2 30.77,58.01 | P.41 38.25,35.19 38.73,35.71 39.71,35.71 v40.5,36.5 | v16.25,40 15.8,40.45 11.5,40.45 10.95,41 C25.2 10.16,43.96 SOC4.7 | 5.08,43.62 SOC4.5 5.08,47.23 5.9,48.05 9.3,48.05 10.1,47.25 10.1,45.69 | SOC2.19 62.23,58.44 D5.2 62.67,56.02 C14.2 | R24.1 C15.2 57.65,57.82 D6.2 57.15,58.32 SOC2.17 | SOC3.17 31.75,59.12 D11.2
  Top 0.406: 34.38,40.88 v34.75,40.5 | 41,35.75 42.75,34.38 48.5,34.38 | 34.62,39.62 34.62,40.38 | 13.07,23.35 R100.2 | R102.2
  Top 0.61: v40.5,36.5 40.5,35.75 41,35.75 | C6.2 51.59,29.72 v51.62,29.75 51.62,33.38 48.61,33.38 C8.2
  Bottom 0.254: C4.2 36,39.5 C5.2 | C3.2 40.5,42.12 | 38.5,39.5 C7.2 39,39.5 | C2.2 40.5,37.25 | 12.5,34.25 C1.2 12.51,36.96 12.9,37.35 12.9,39.95 13.4,40.45 15.8,40.45 v16.25,40 | 87.63,59.52 SOC1.19 | R9.1 C10.2 | 82.55,59.1 SOC1.17 | R11.1 C11.2 | 77.47,58.68 SOC1.15 | 65.5,62.88 64.14,62.88 SOC2.19 60.31,62.88 59,62.88 57.15,61.02 SOC2.17 55.23,62.88 54,62.88 52.09,60.96 | 52.09,60.96 SOC2.15 | R15.1 C13.2 67.4,56.25 | 52.09,60.96 50.17,62.88 | 48.88,62.88 46.99,60.99 SOC2.13 45.08,62.88 43.88,62.88 41.96,60.96 SOC2.11 39.99,62.88 38.75,62.88 SOC3.19 34.91,62.88 33.62,62.88 31.75,61 SOC3.17 29.84,62.88 28.62,62.88 26.71,60.96 SOC3.15 24.75,62.88 23.5,62.88 SOC3.13 21.41,60.96 19.5,62.88 18.41,62.88 SOC3.11 | R13.1 C12.2 | 72.39,58.51 SOC1.13 | SOC3.11 16.36,60.96 14.6,59.2 14.6,48.55 13.8,47.75 10.6,47.75 10.1,47.25 10.1,45.69 SOC4.7 | SOC3.11 16.5,61 | LCDHEADER.1 | 37.25,10.25 37.25,10.12 | 67.31,58.59 SOC1.11 67.31,61.06 | SOC5.2 33.39,18.84 33.3,18.75 | 34.15,18.75 30.37,18.75 SOC5.4 | SOC6.10 36.51,18.75 34.25,18.75 | SOC6.6 50.5,19.04 52.5,19.04 | 52.5,18.8 53.81,20.11 SOC6.4 55.59,19.02 57.12,19.02 58.89,20.79 SOC6.2 60.7,19 62.34,19 64.07,20.73 SOC7.10 | SOC7.10 65.88,19 67.35,19 SOC7.8 70.96,19 72.42,19 SOC7.6 76.05,18.99 77.61,18.99 79.31,20.68 SOC7.4 81.12,19 82.66,19 84.39,20.73 SOC7.2 | SOC5.10 15.13,18.75 16.41,18.75 | SOC5.8 20.21,18.75 21.29,18.75 | SOC5.6 25.29,18.75 25.93,18.75 | v62.5,30.5 62.5,26 62.75,25.75 62.75,22.13 SOC7.10
  Bottom 0.305: C9.2 87.63,59.52 | 50.17,62.88 48.88,62.88 | 67.31,61.06 65.5,62.88
  Bottom 0.406: 40.5,42.12 v40.5,42.62 | 38.5,39.5 40.6,38 C2.2 | 39,39.5 39,40.25 40.6,41.5 C3.2 | 36,39.5 C7.2 | C4.2 35.25,40.27 v34.75,40.5 | ---.3 2.89,34.25
  Bottom 0.61: 40.5,37.25 v40.5,36.5 40.5,35.88 38.88,35.88 38,34.88 34,34.88 33.38,34.25 12.5,34.25 2.89,34.25 5,32.64 5,24.2 CONTRAST.1 2.54,21.84 5.62,18.75 16.41,18.75 21.29,18.75 25.93,18.75 33.3,18.75 34.15,18.75 34.25,18.75 37.25,15.75 37.25,10.25 | v51.62,29.75 52.5,29 52.5,19.04 52.5,18.8 52.5,18.38 55.88,15.25 89.25,15.25 89.73,14.77 POWER.4 | 37.25,10.12 LCDHEADER.1
  pour Top: 43.16,34.55 43.1,28.21 53.34,28.18 53.45,34.55
  pour Bottom: 0.85,79.5 99.3,79.5 99.3,0.8 0.85,0.8

### Text on the board
Top: Dave Zieglgansberger / Aug 2017, Rev 1.0